# EAGLE board haasoscope_pro_fpga_board - v1.0 (EAGLE 9.6.2), part 1 of 2
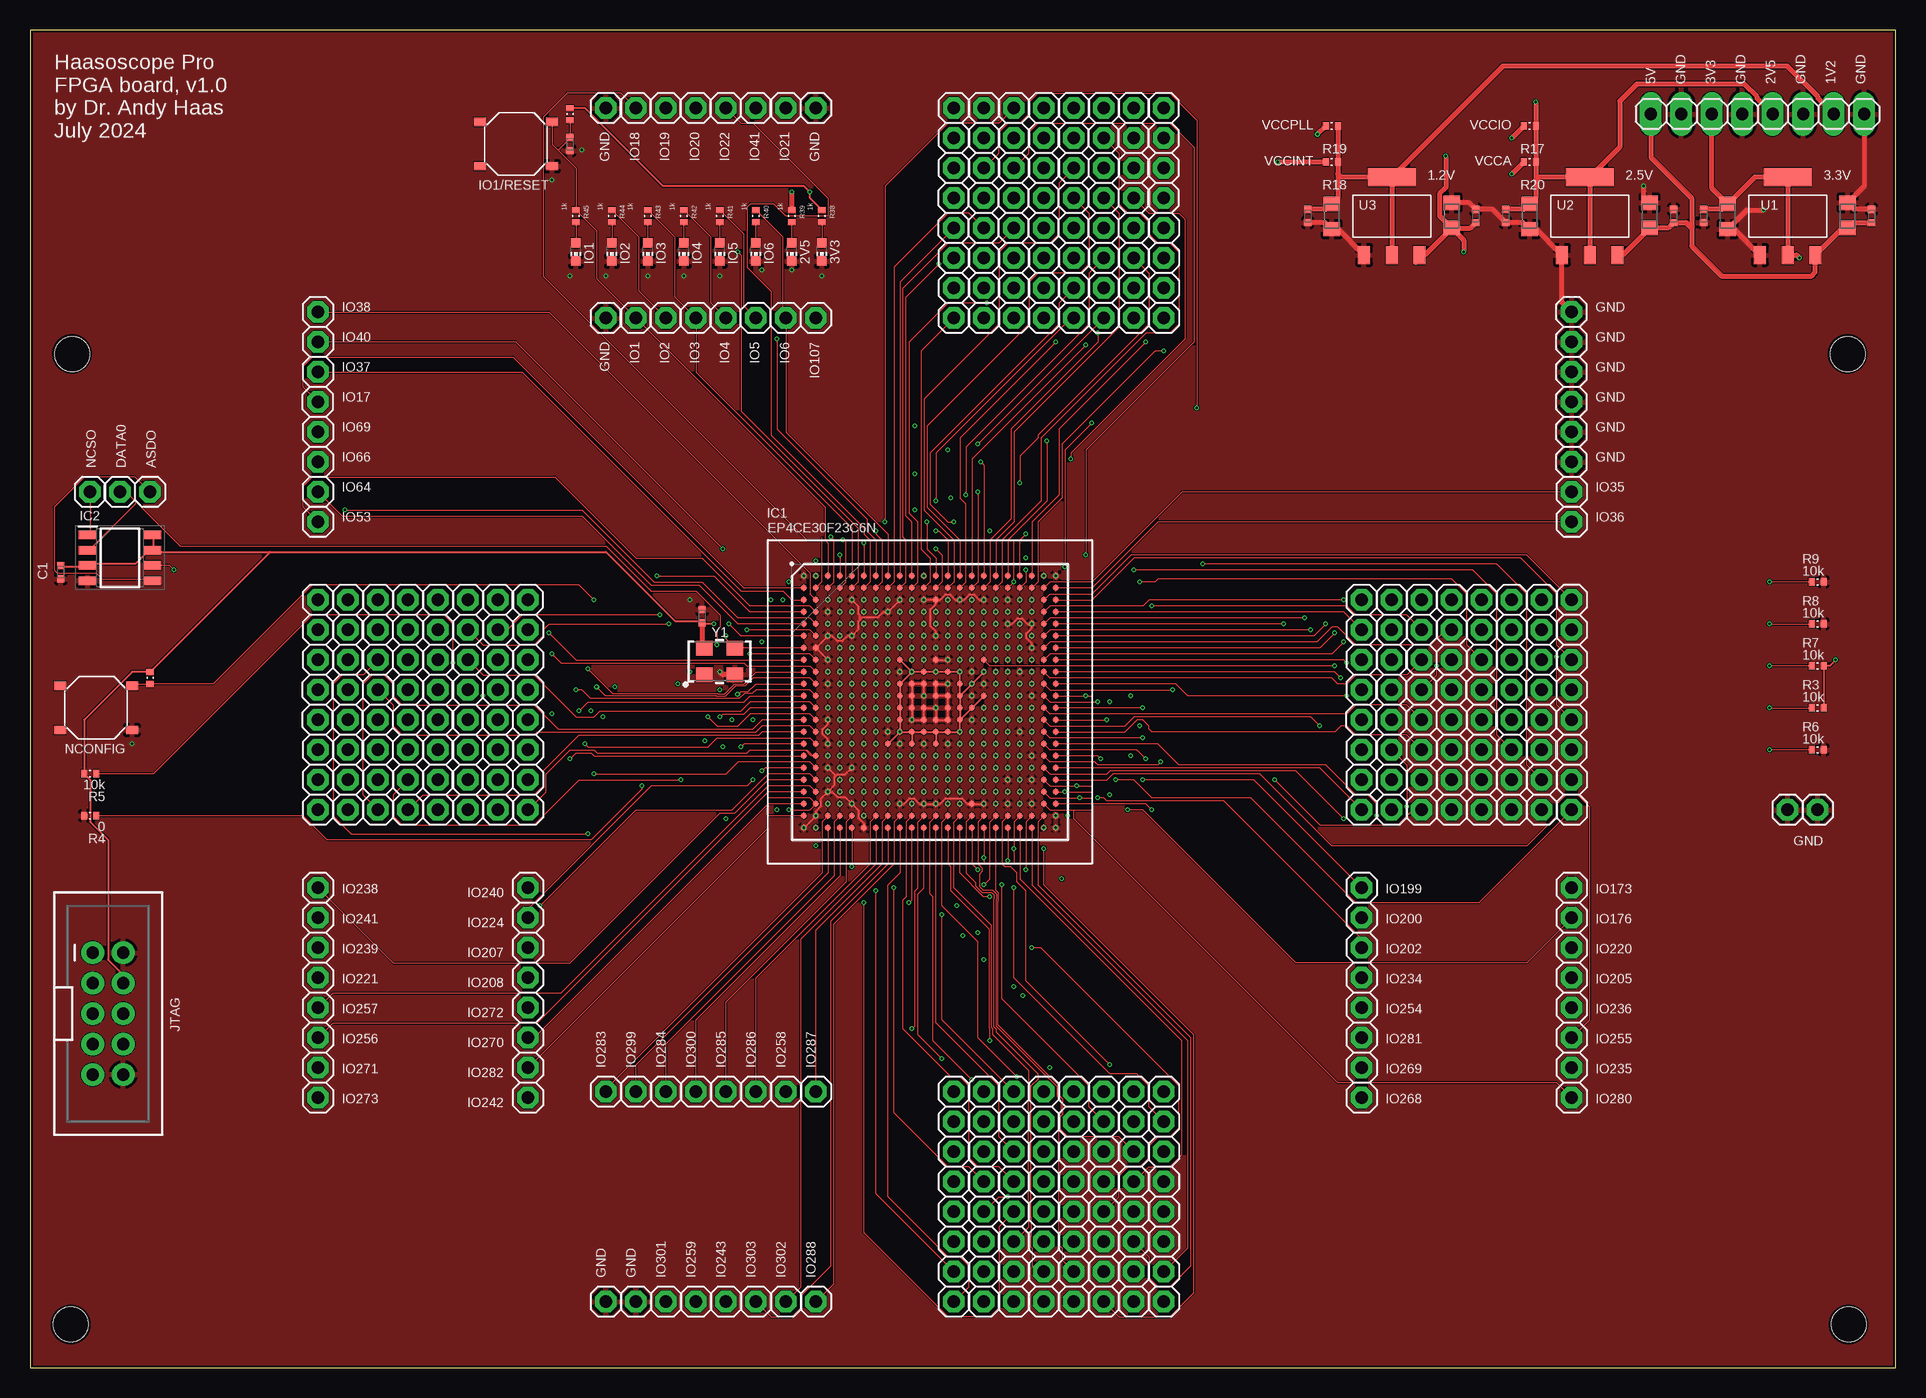
[diagram p4: board, top side]
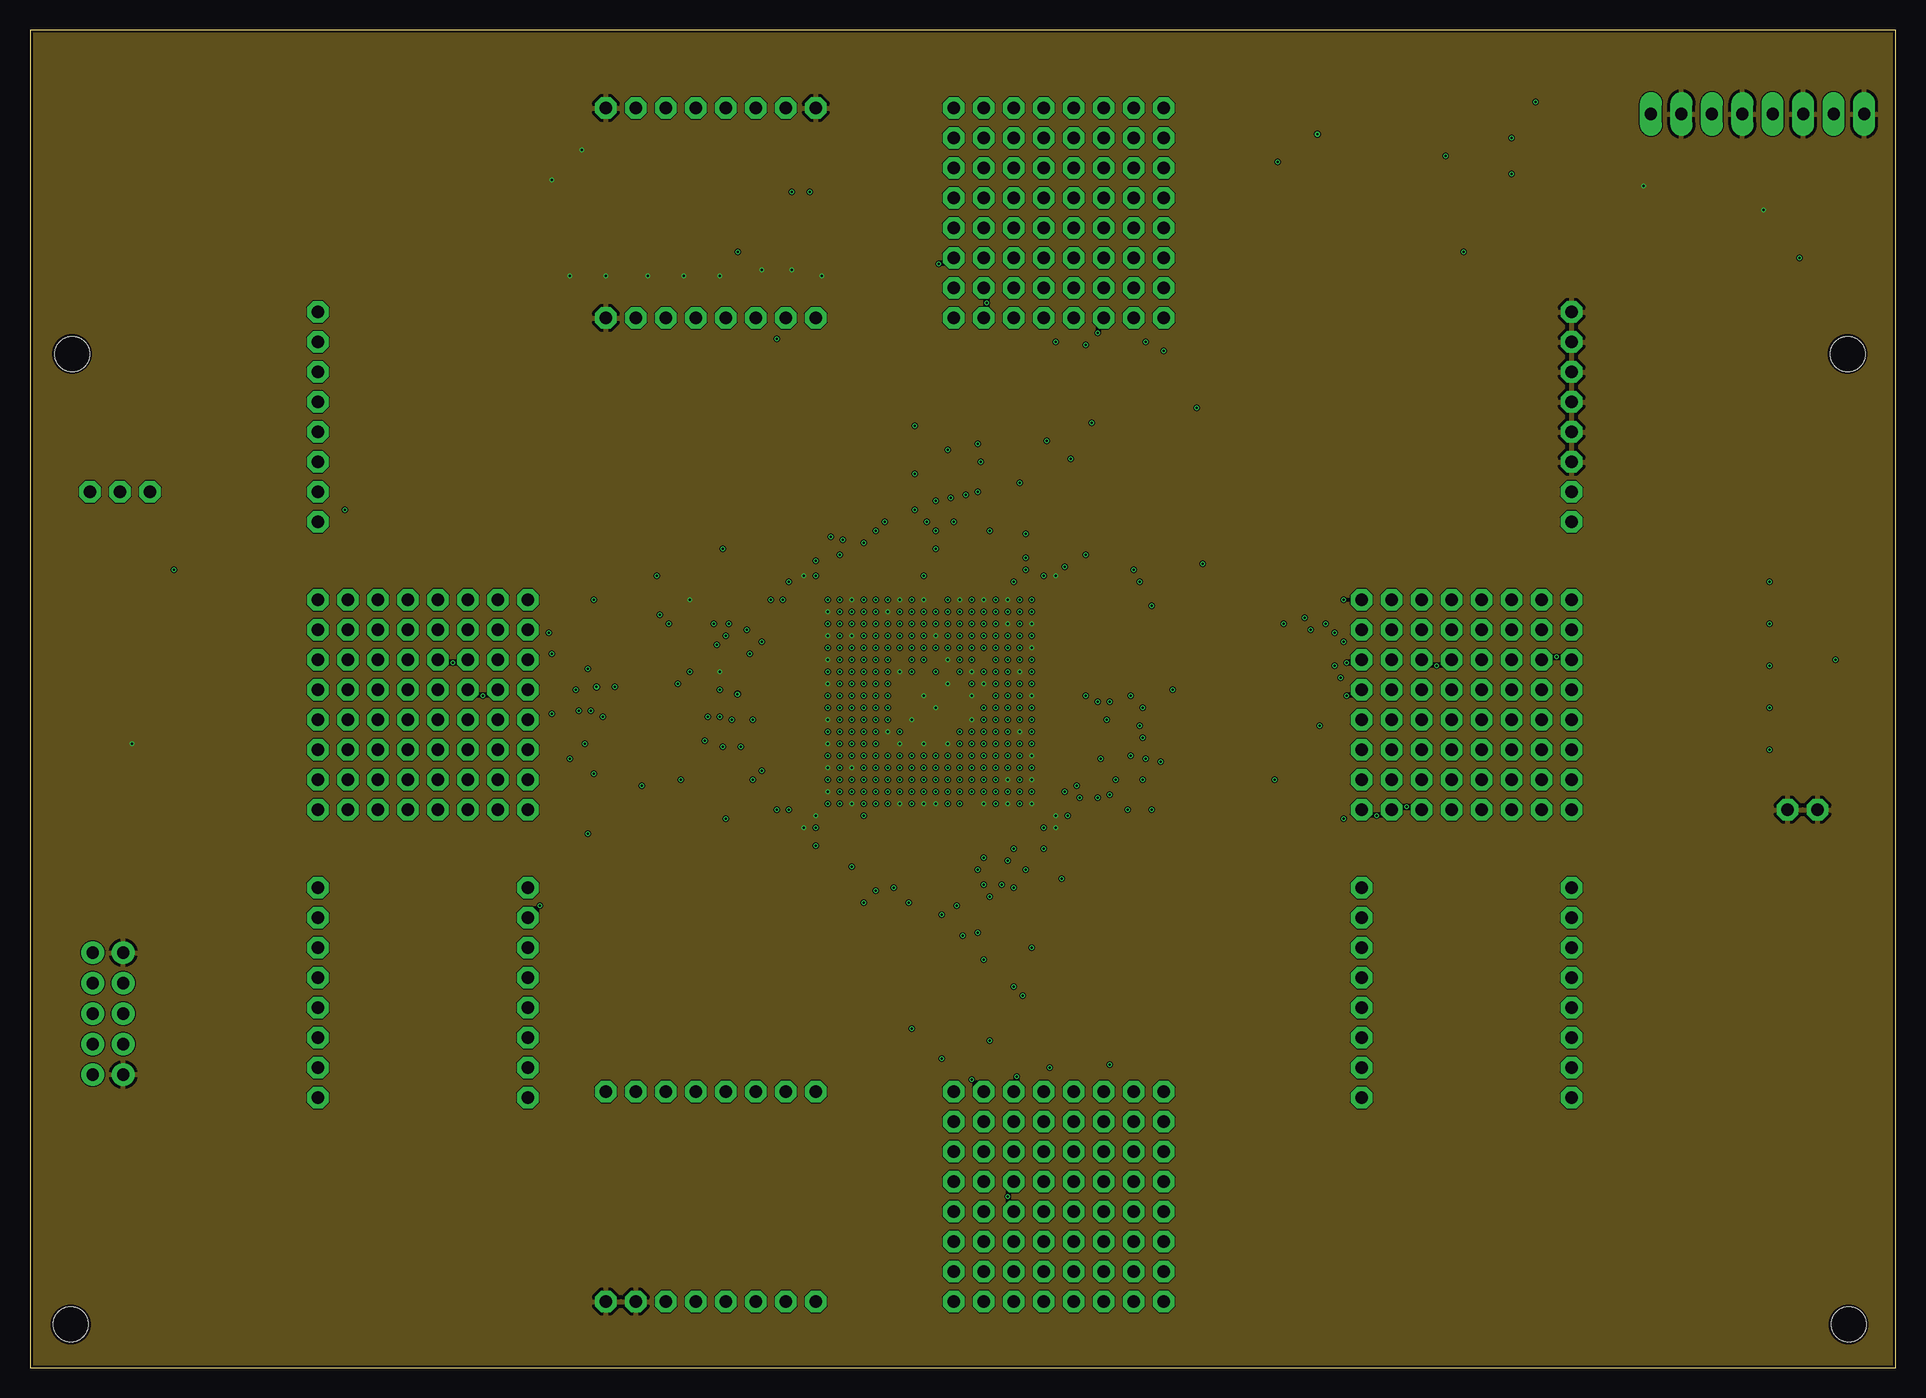
[diagram p5: board, inner layer topgnd]
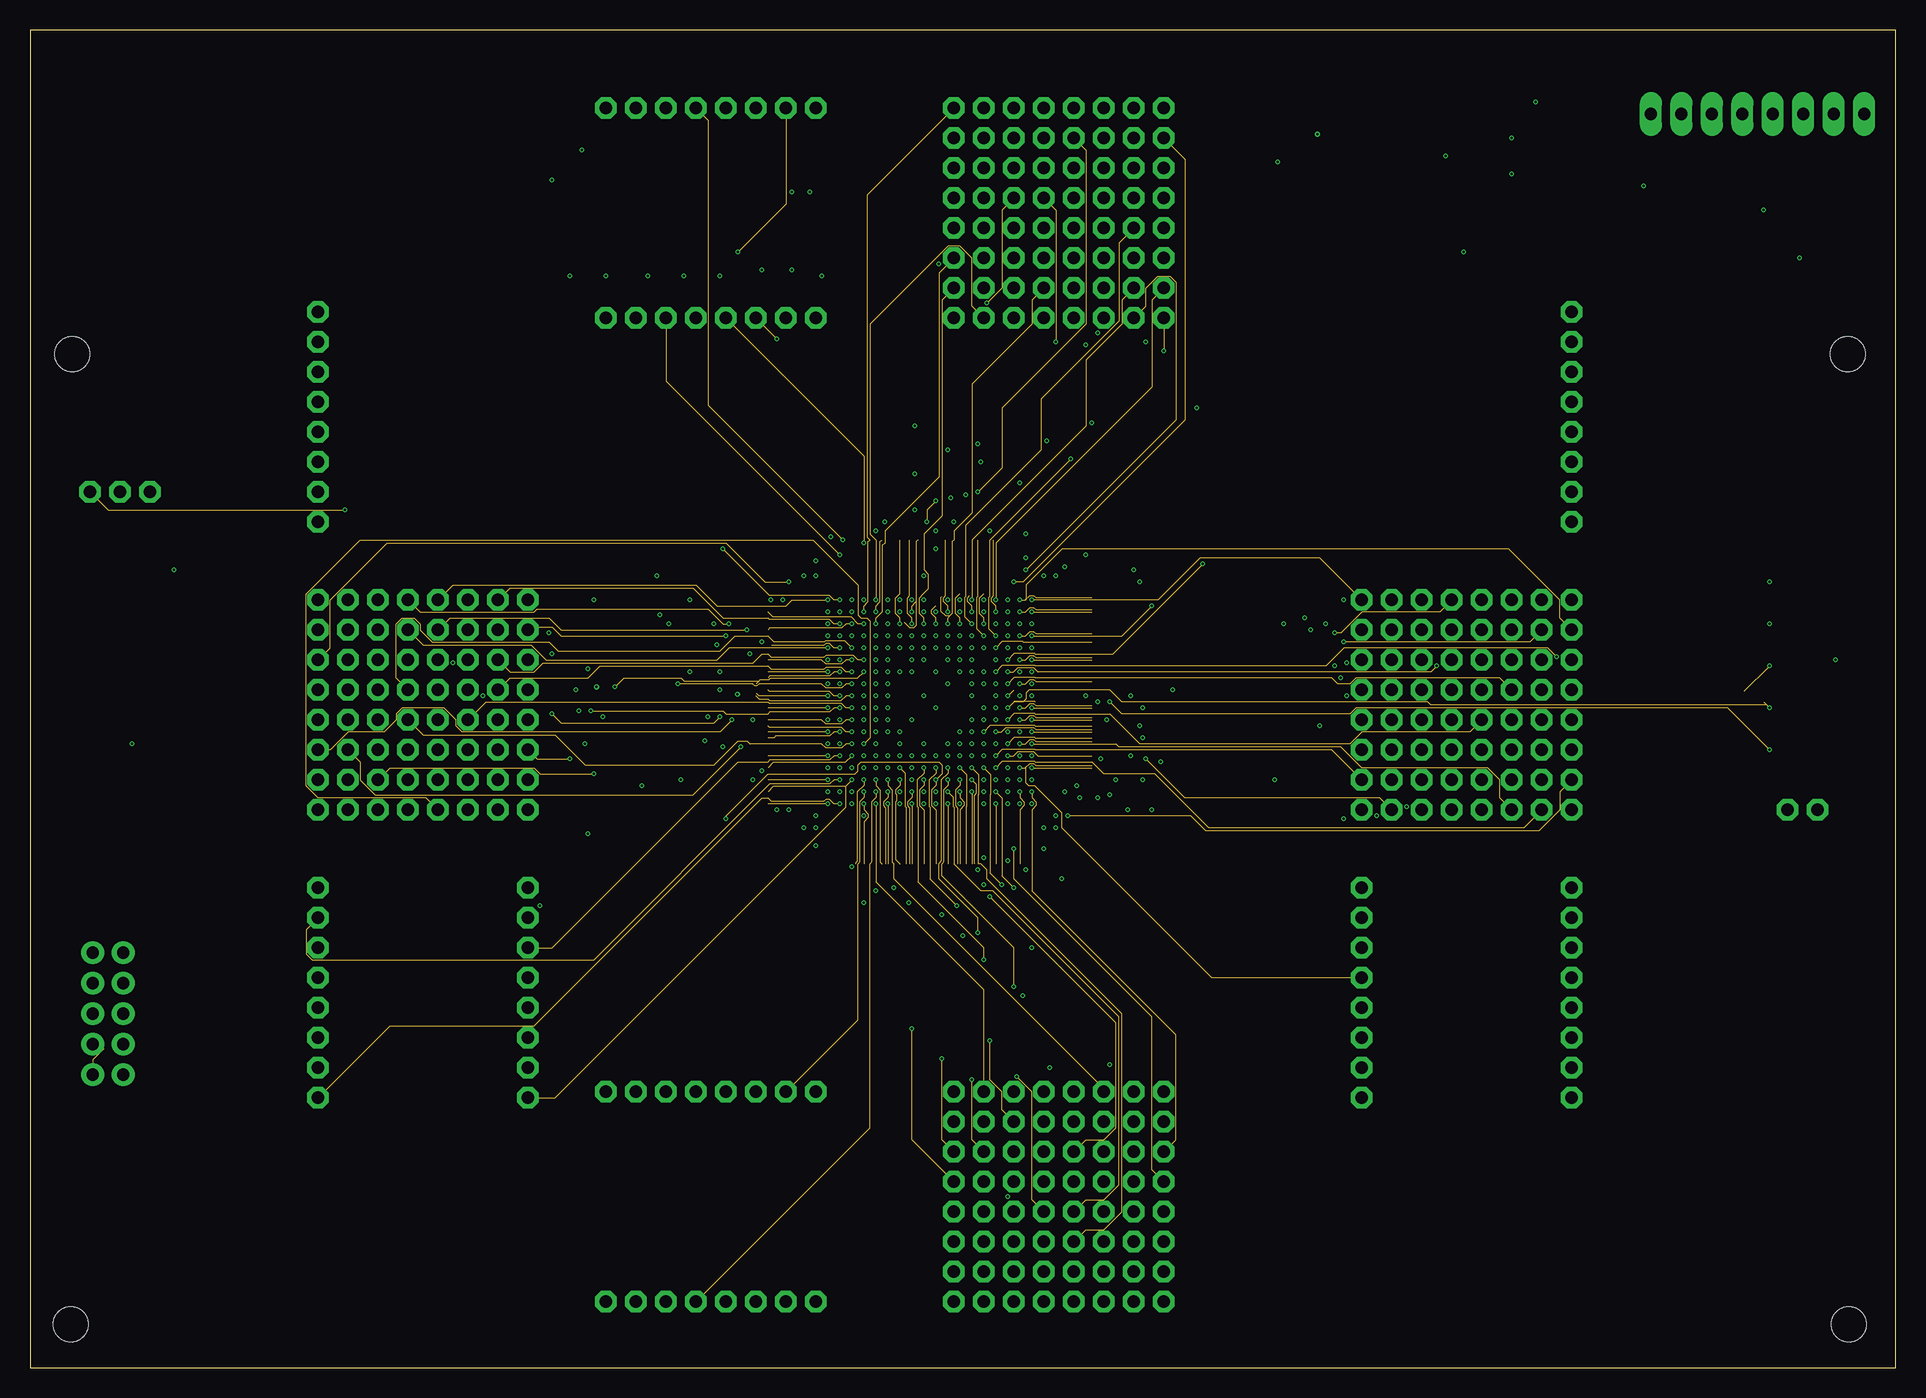
[diagram p6: board, inner layer sig2]
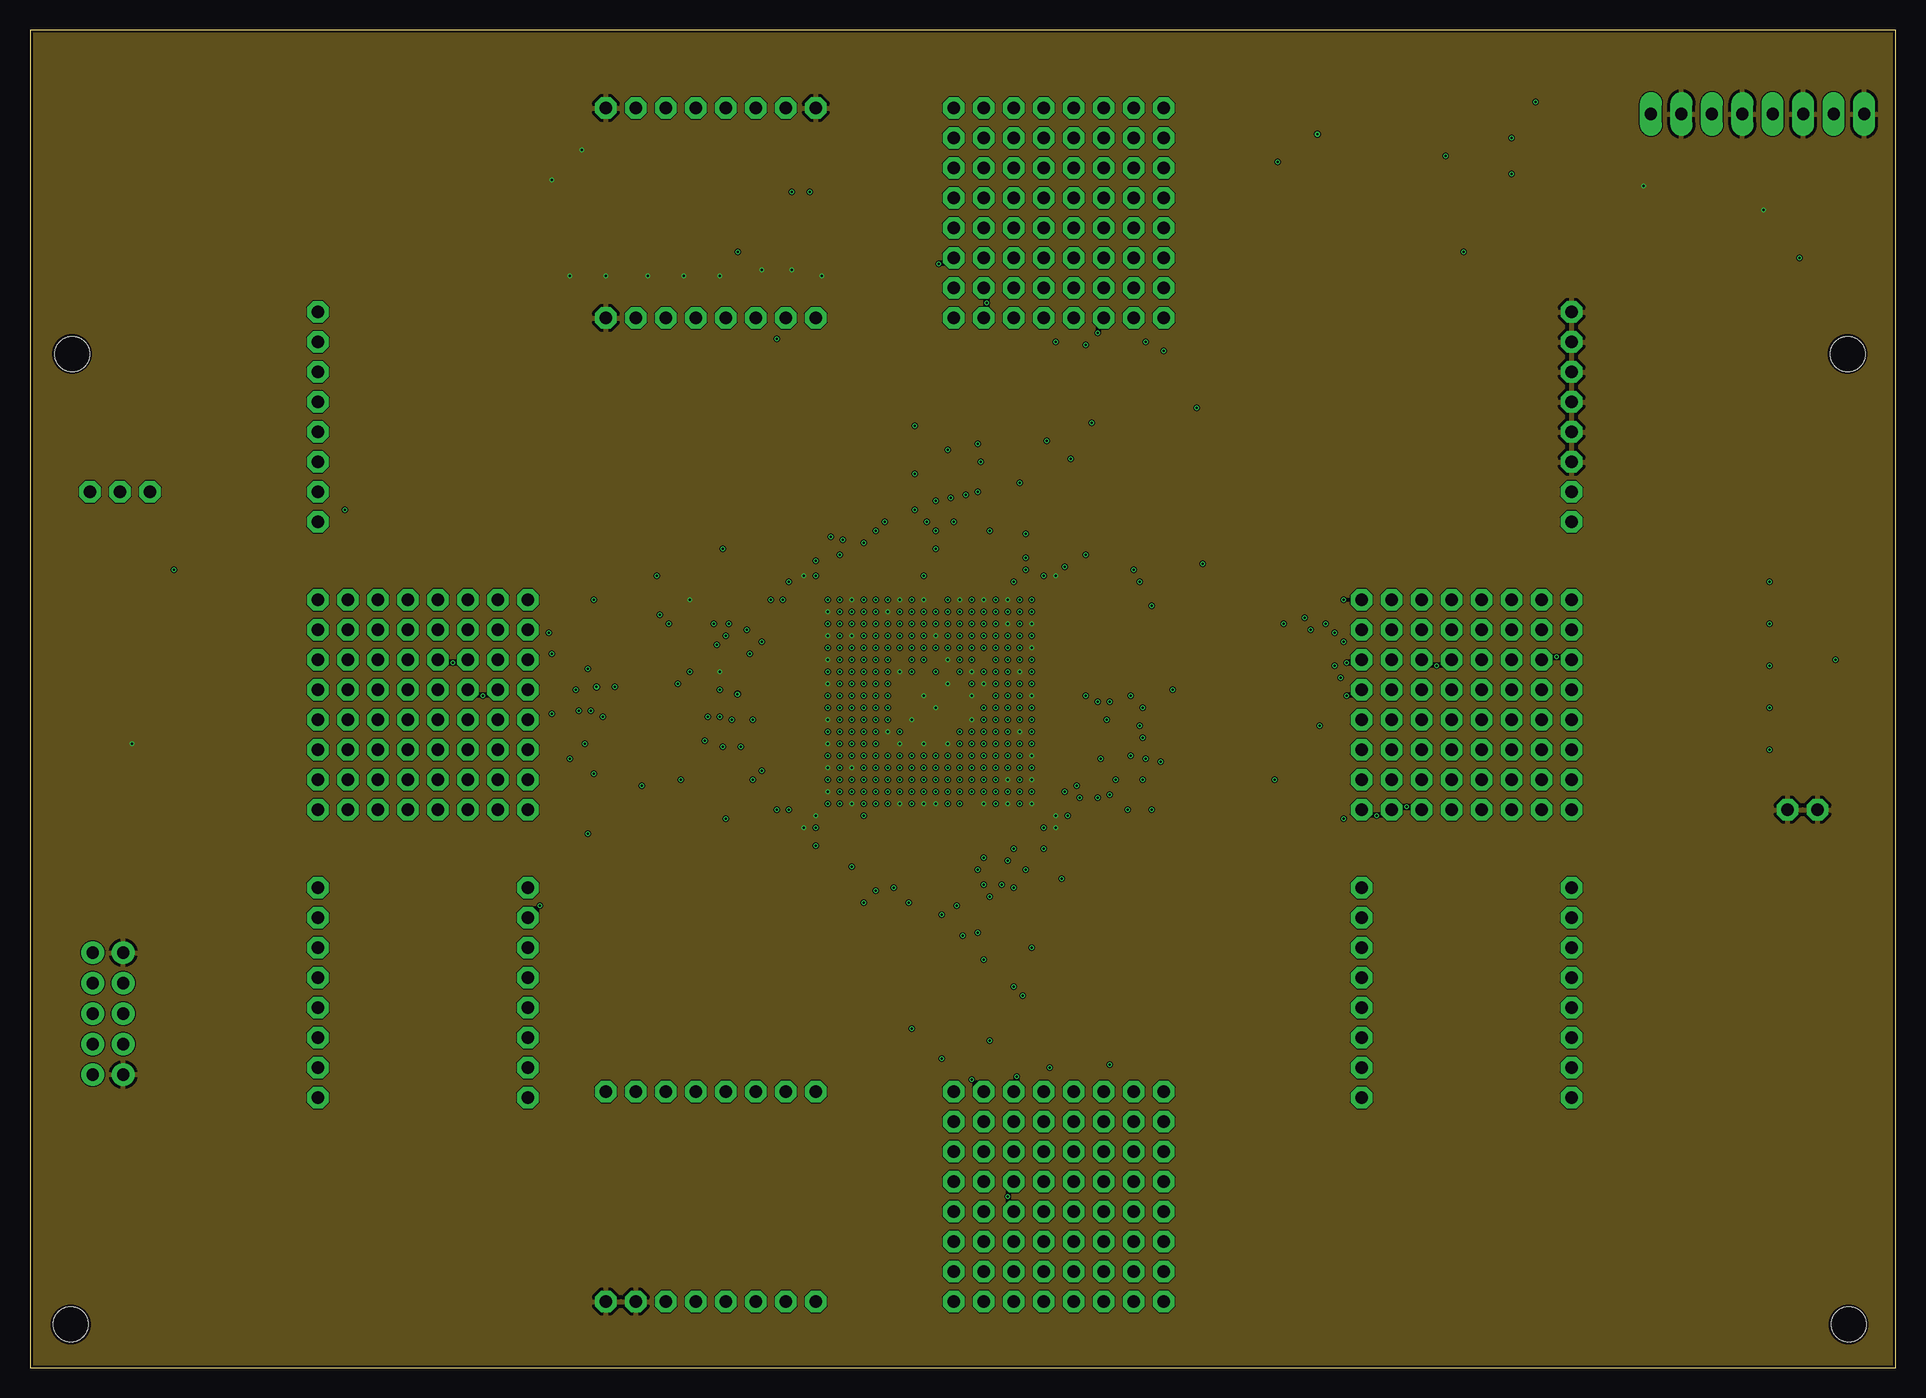
[diagram p7: board, inner layer sig2gnd]
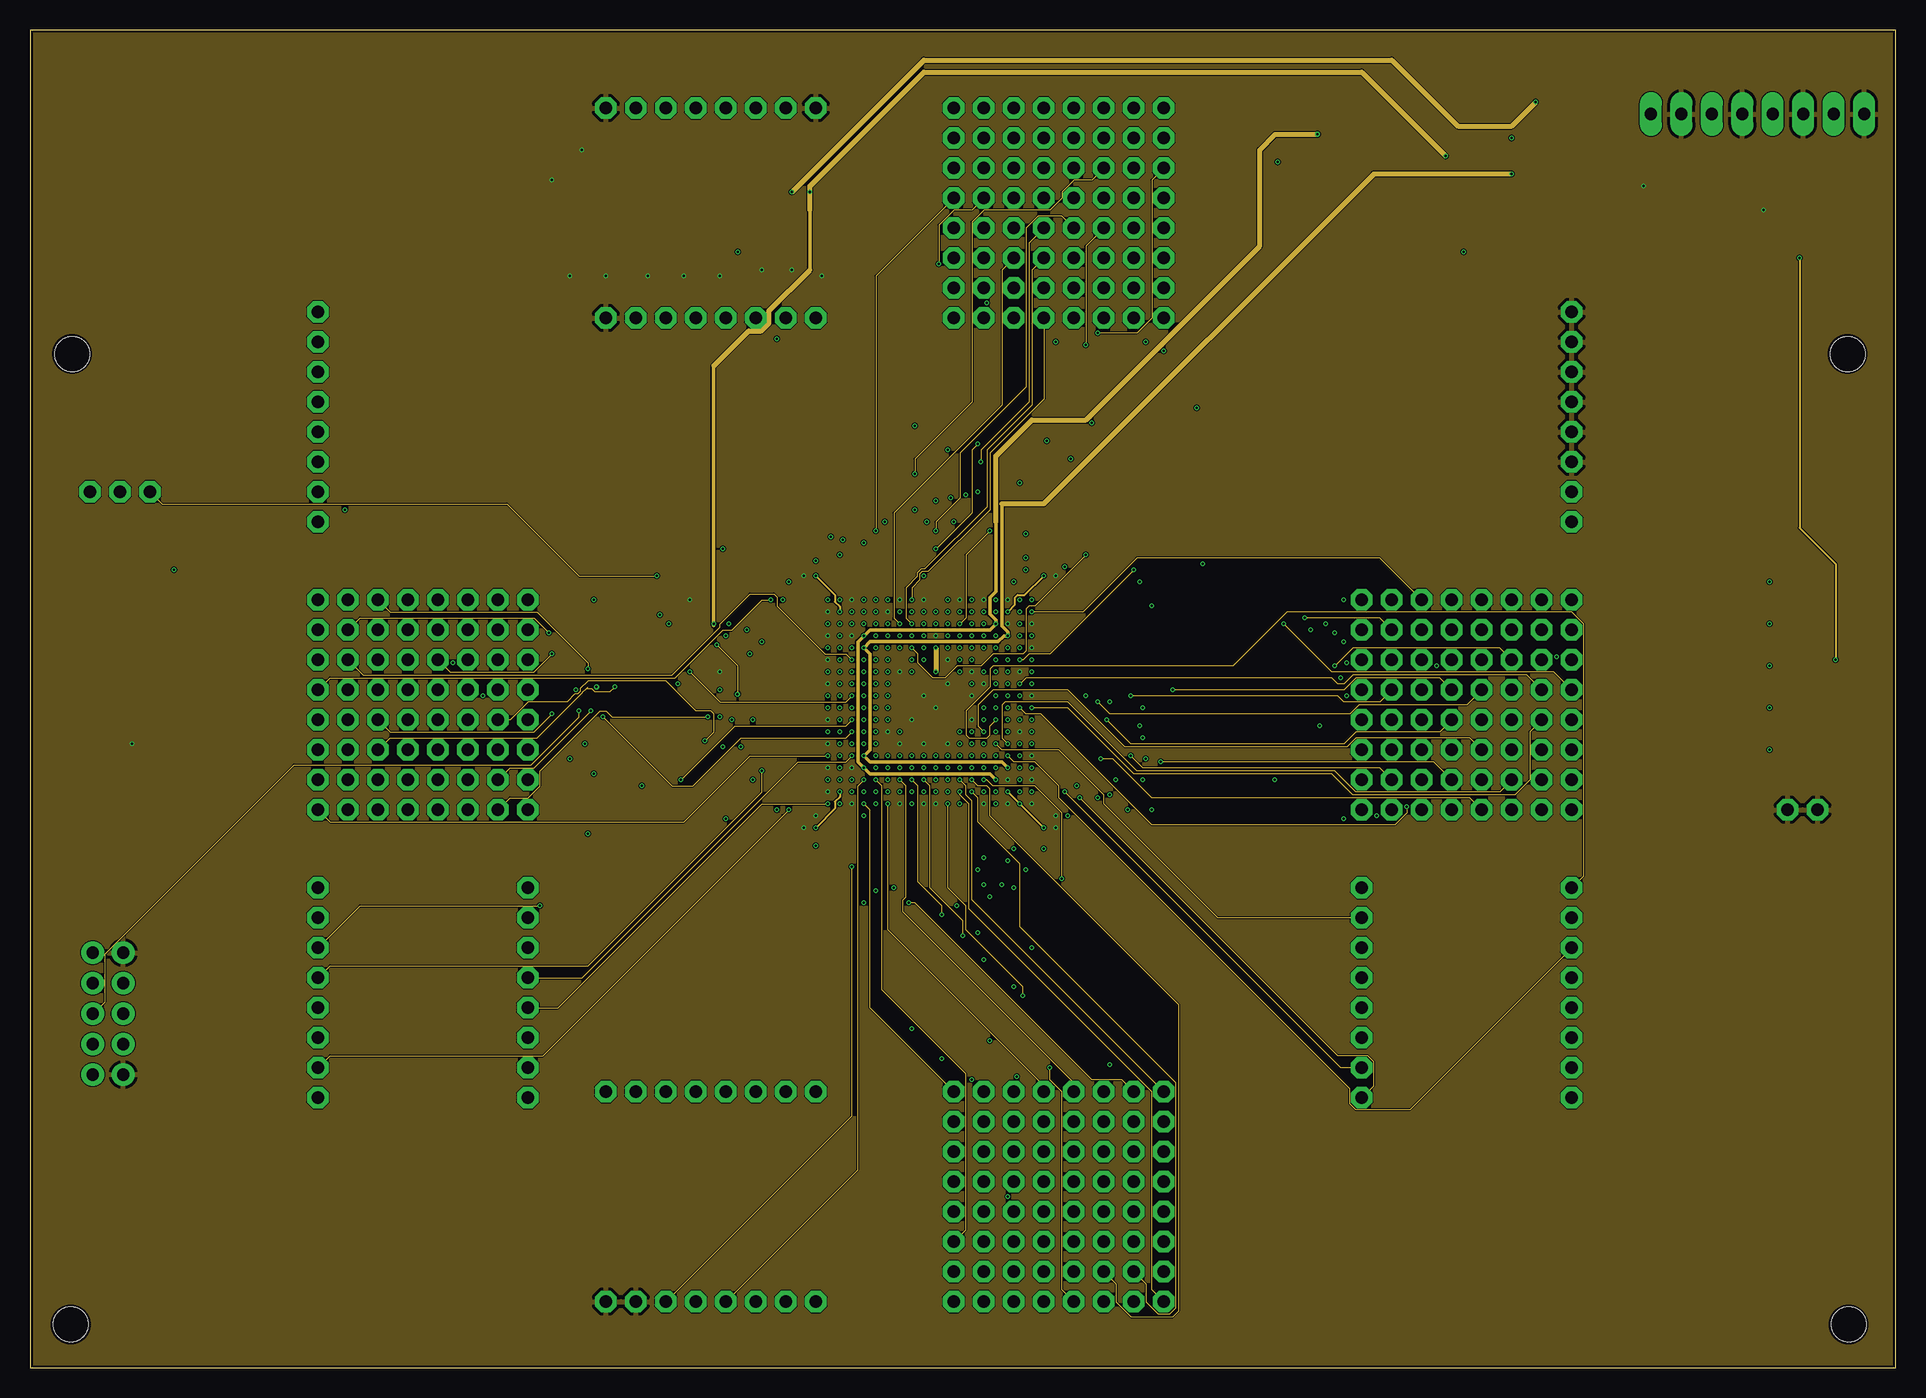
[diagram p8: board, inner layer pow1]
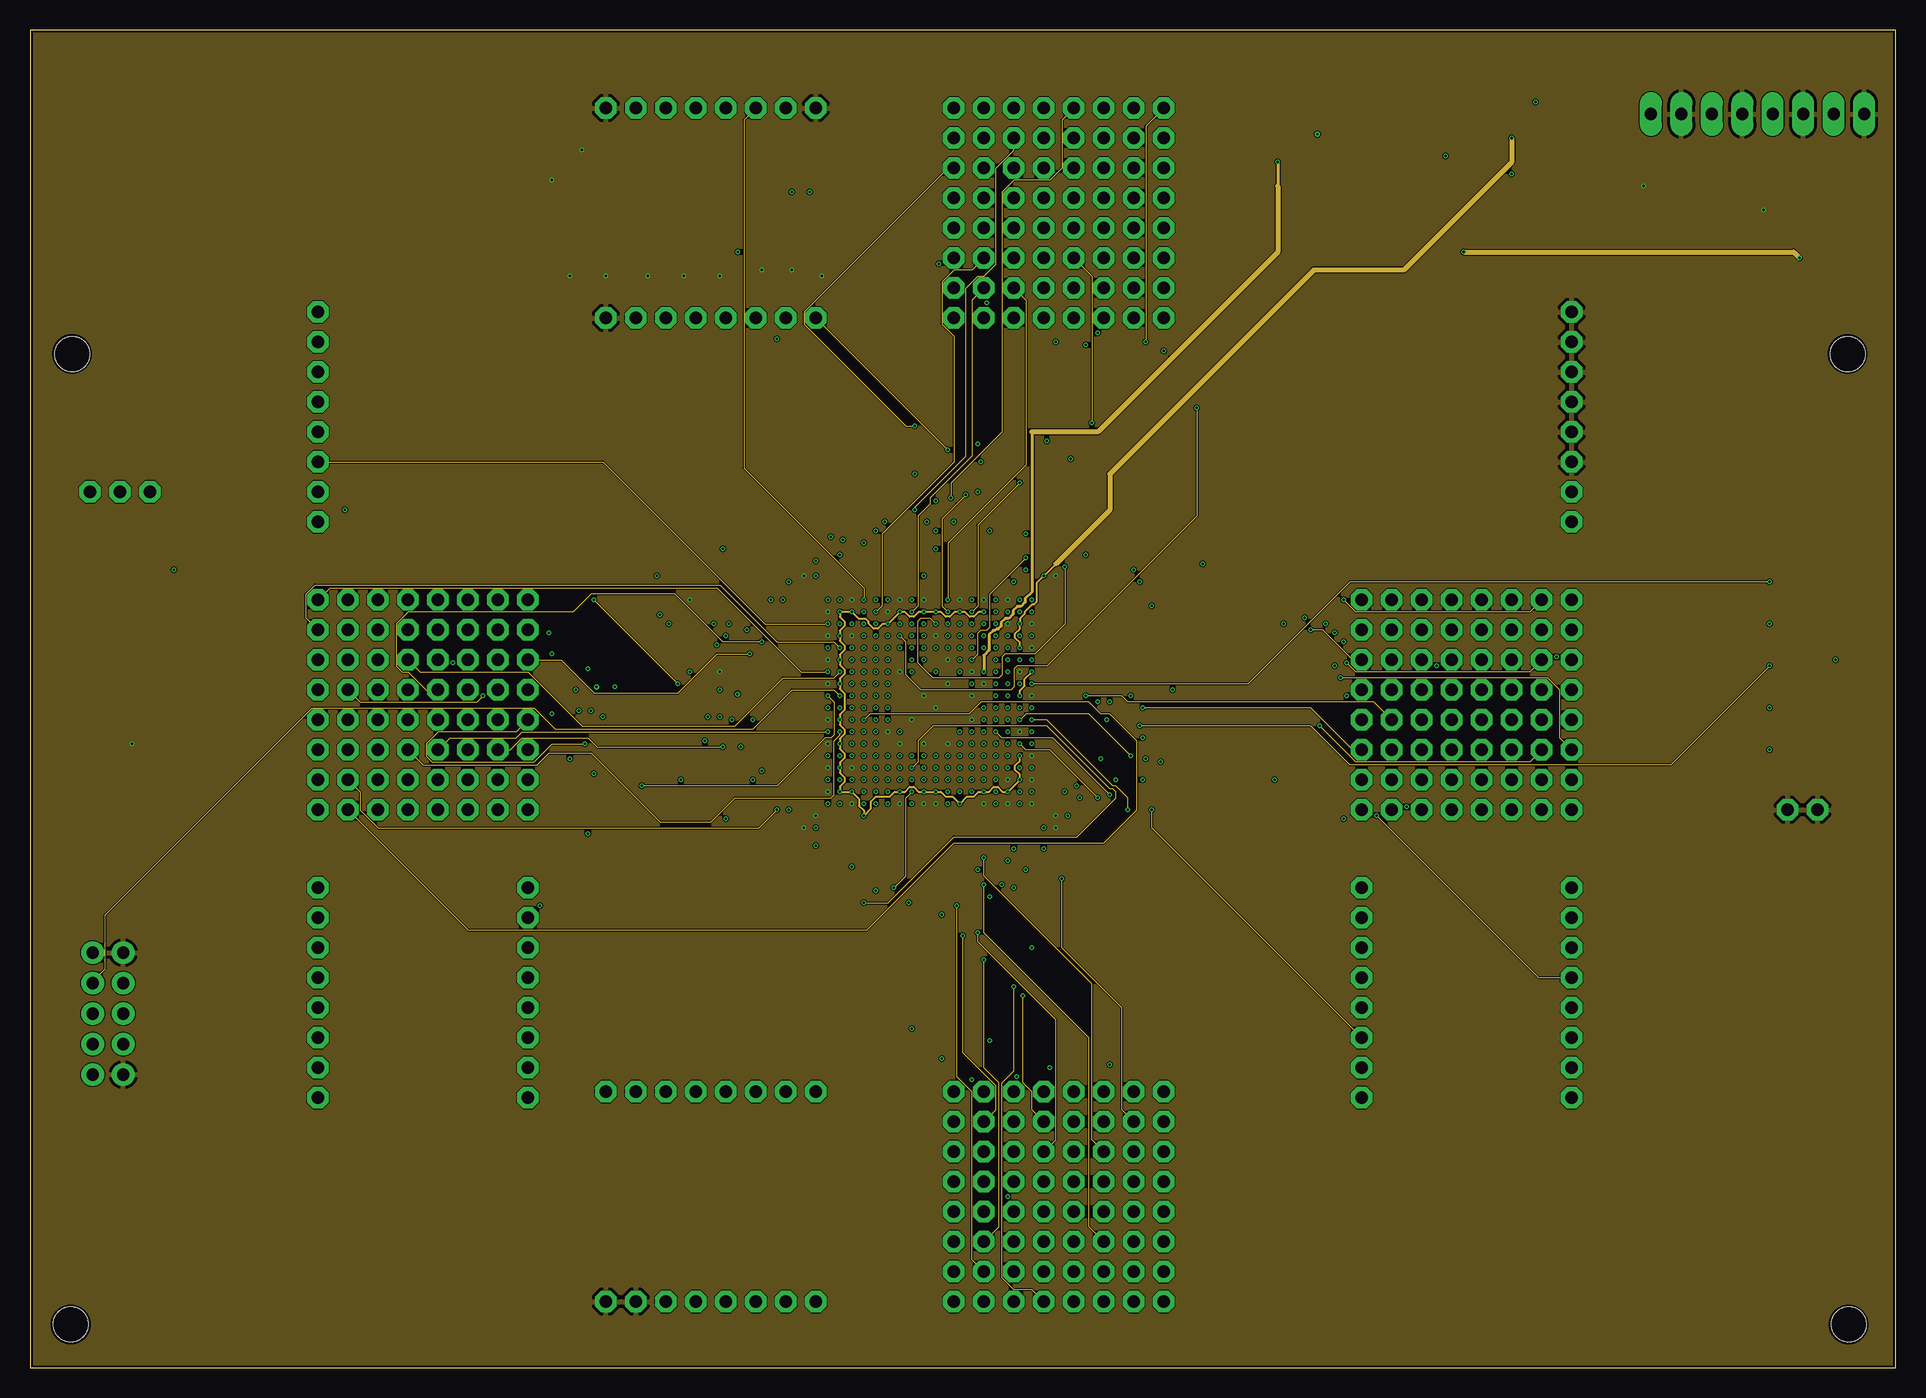
[diagram p9: board, inner layer pow2]
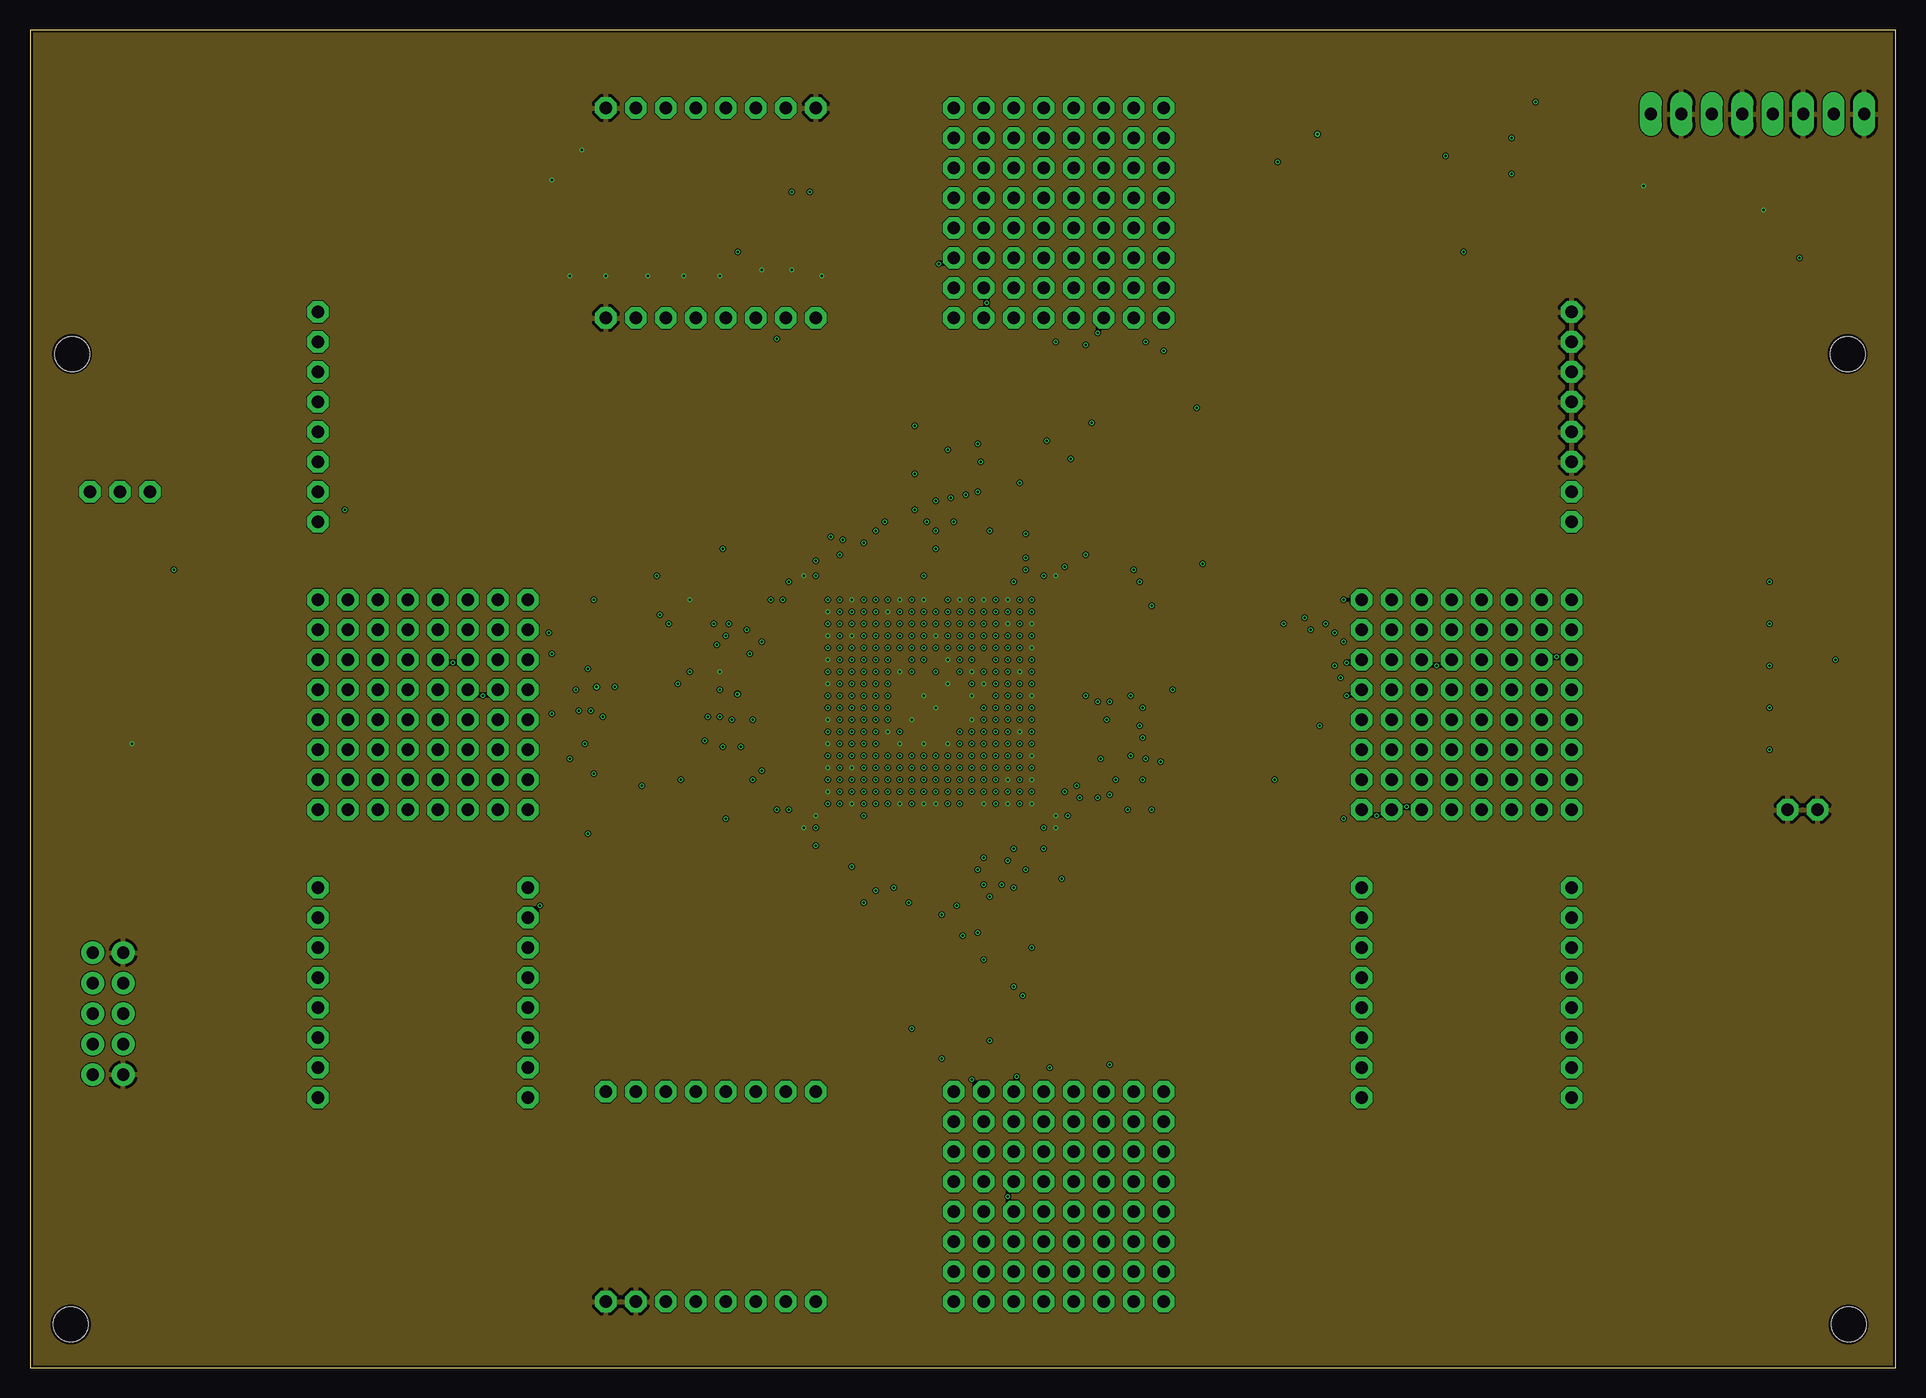
[diagram p10: board, inner layer sig4gnd]
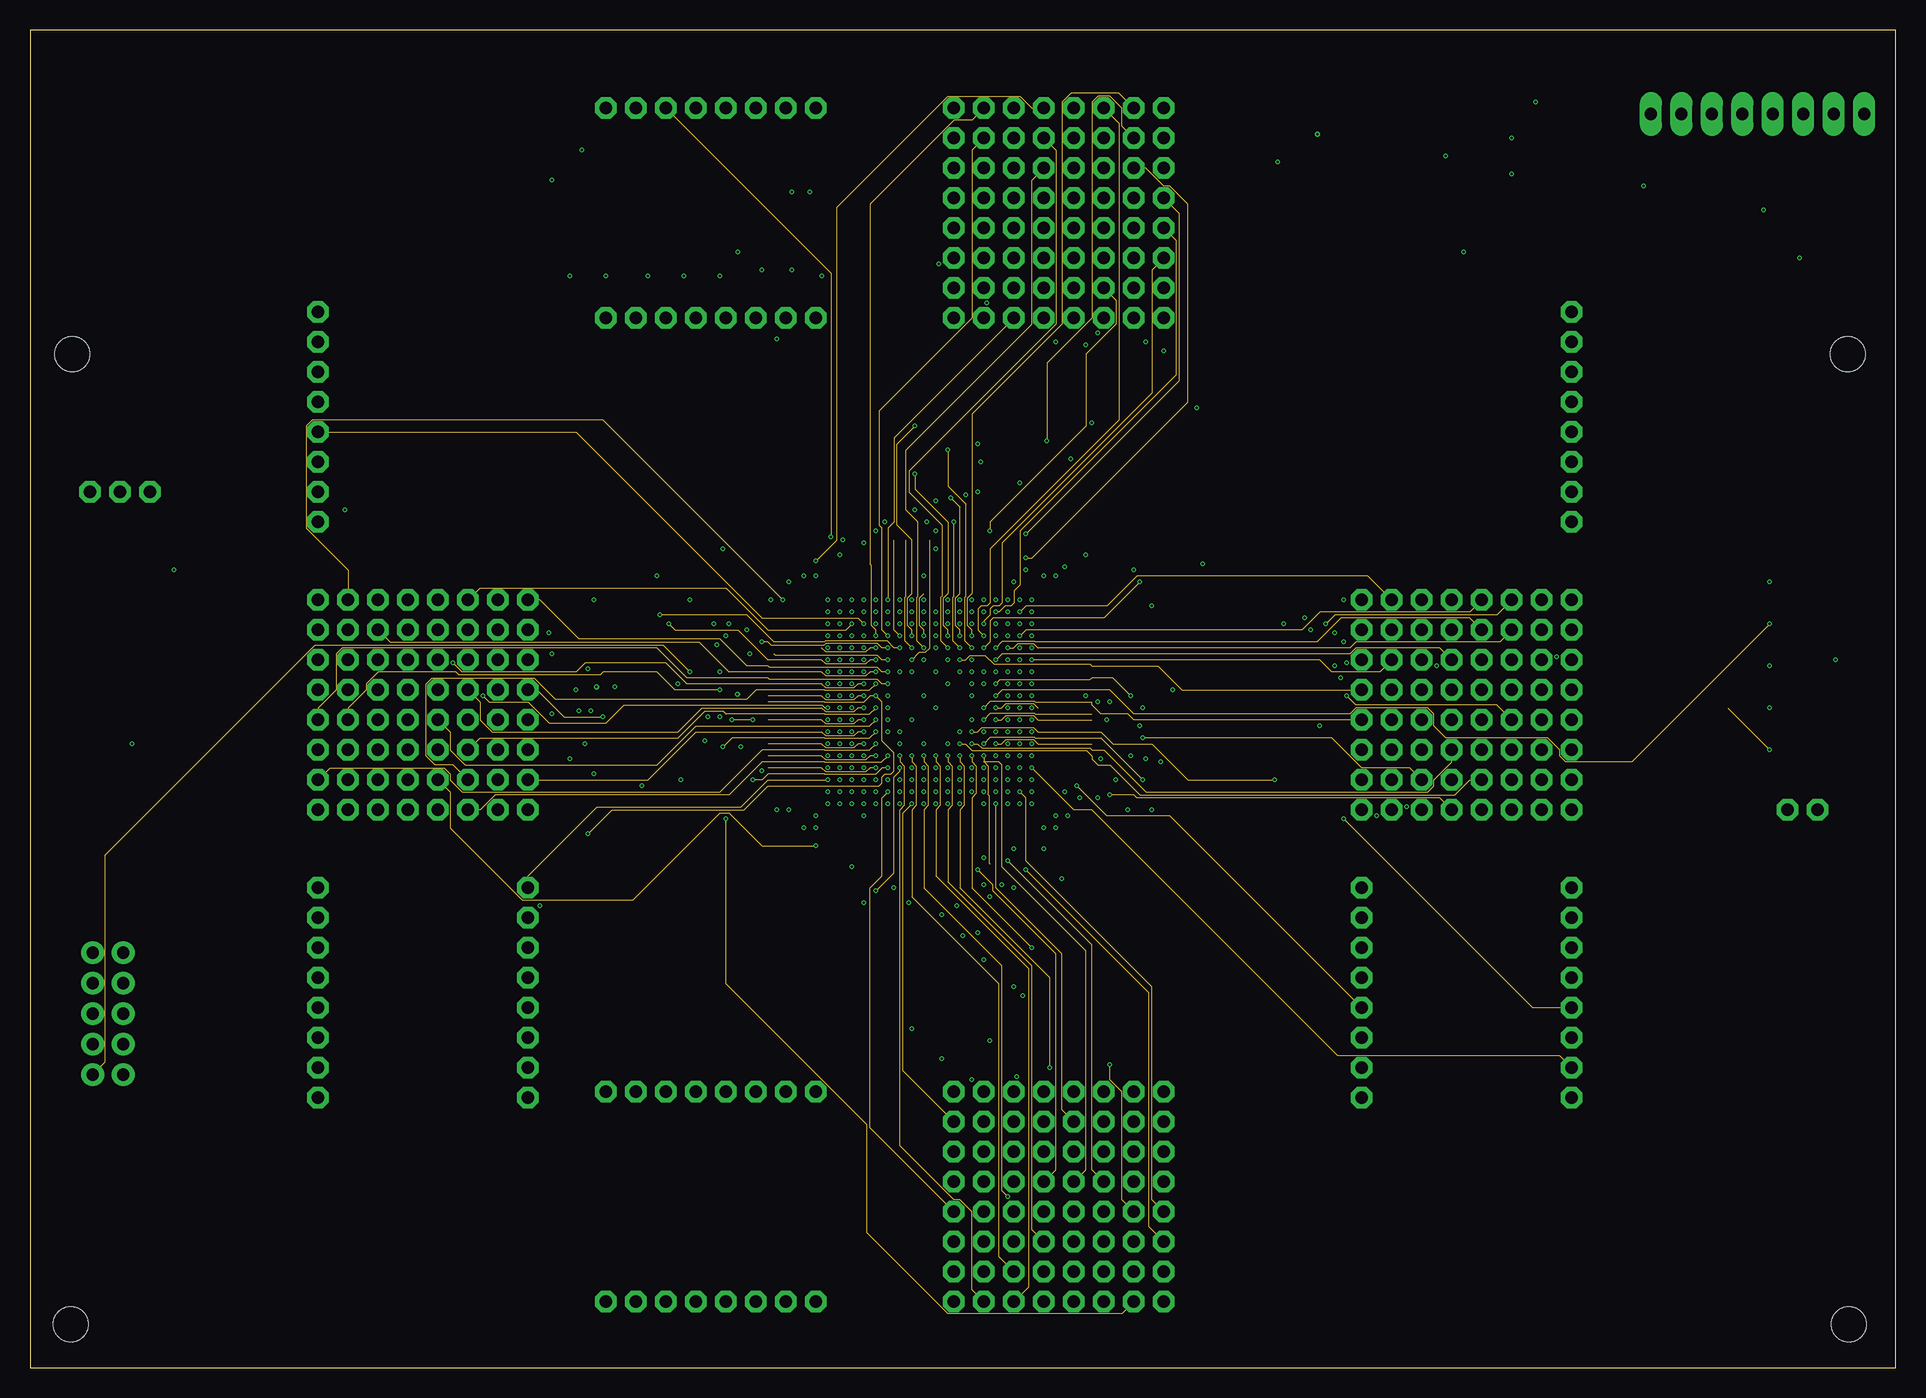
[diagram p11: board, inner layer sig4]
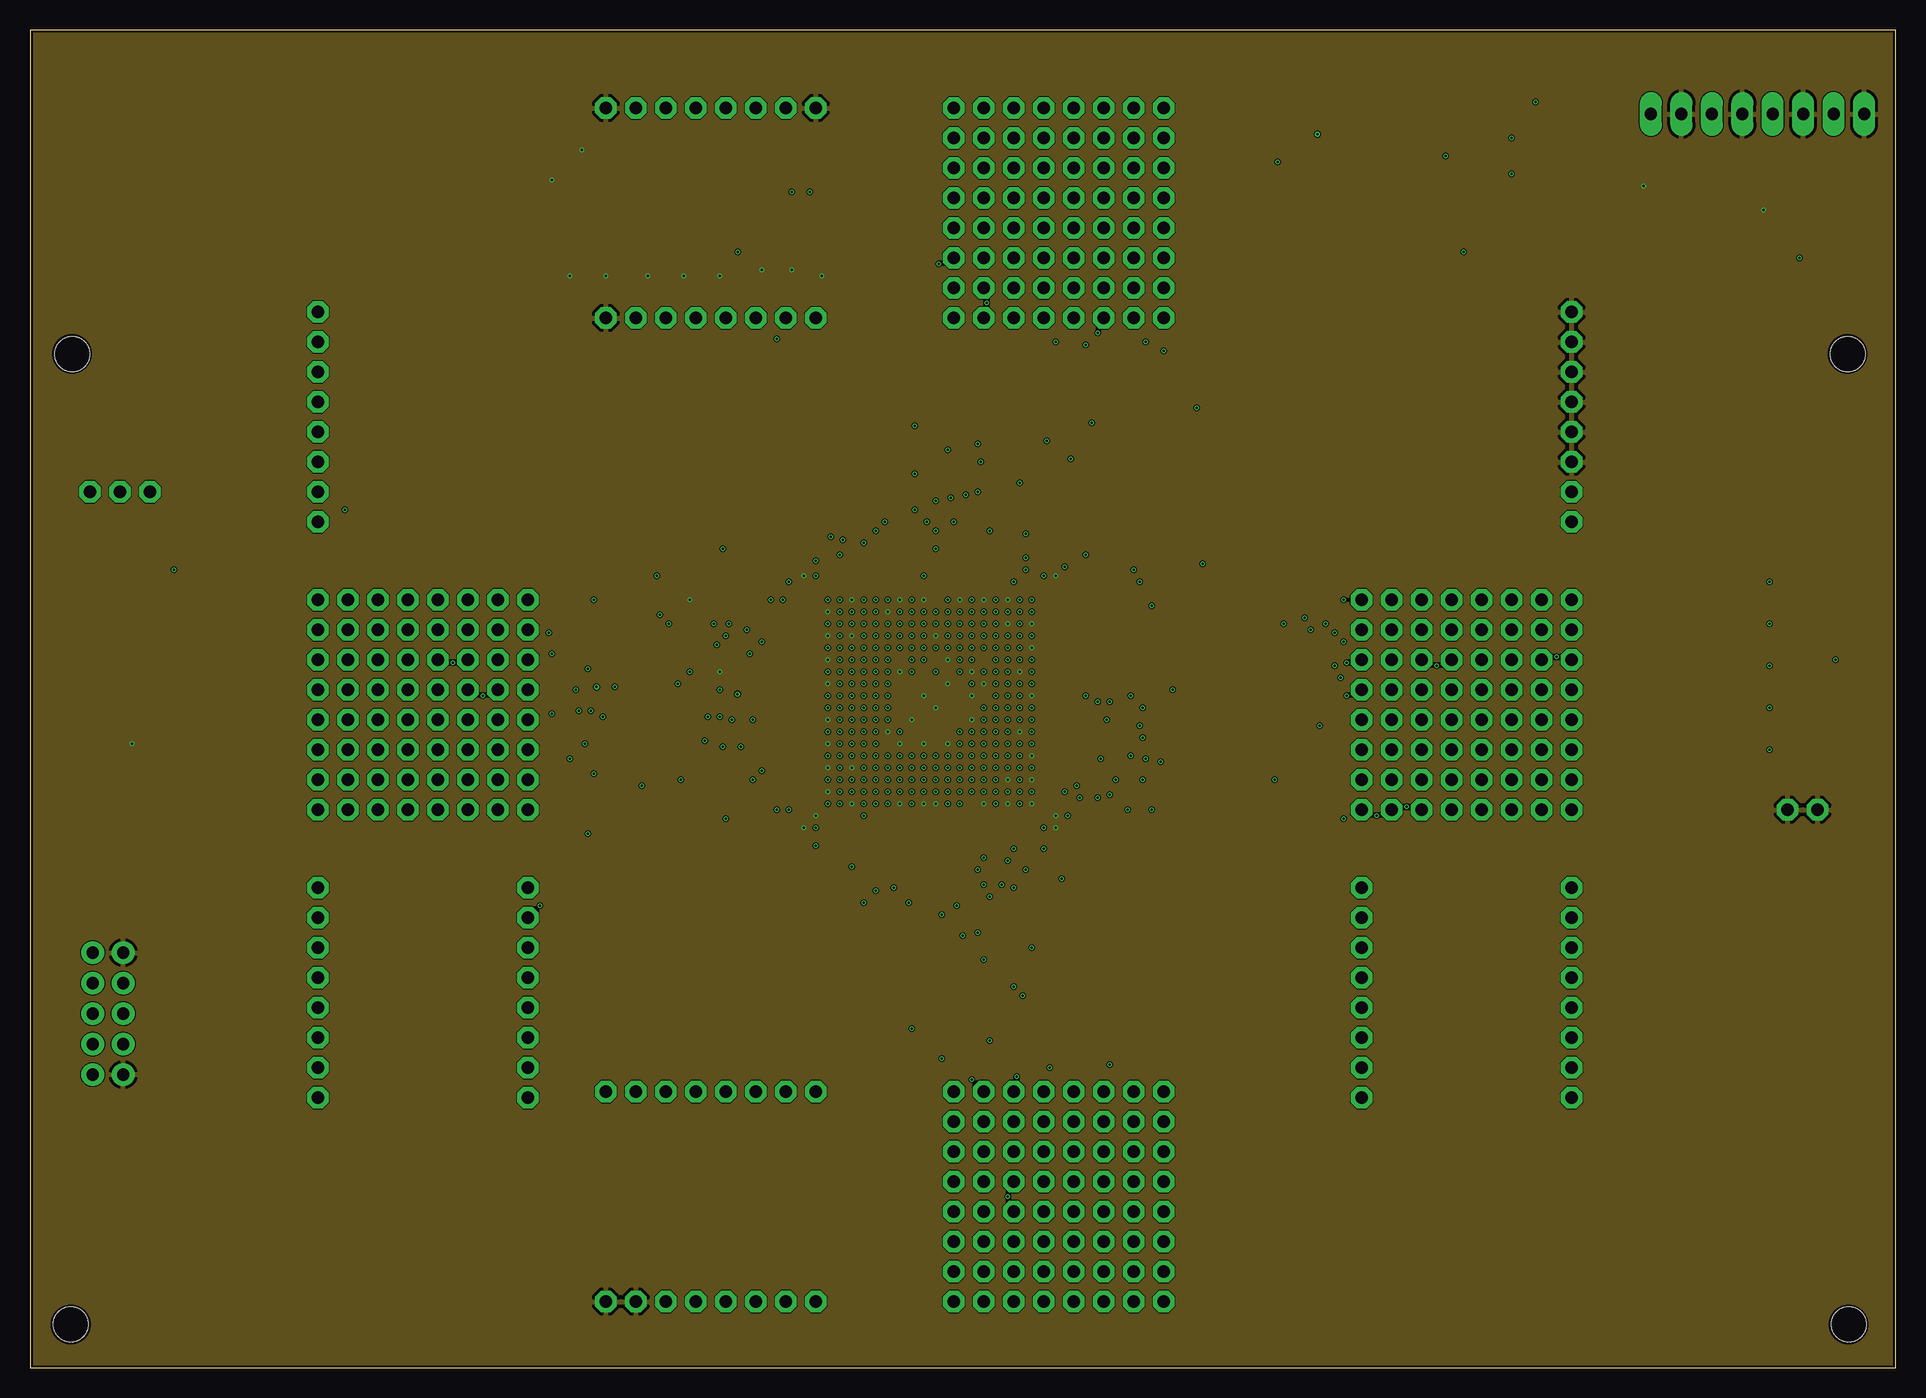
[diagram p12: board, inner layer sig5gnd]
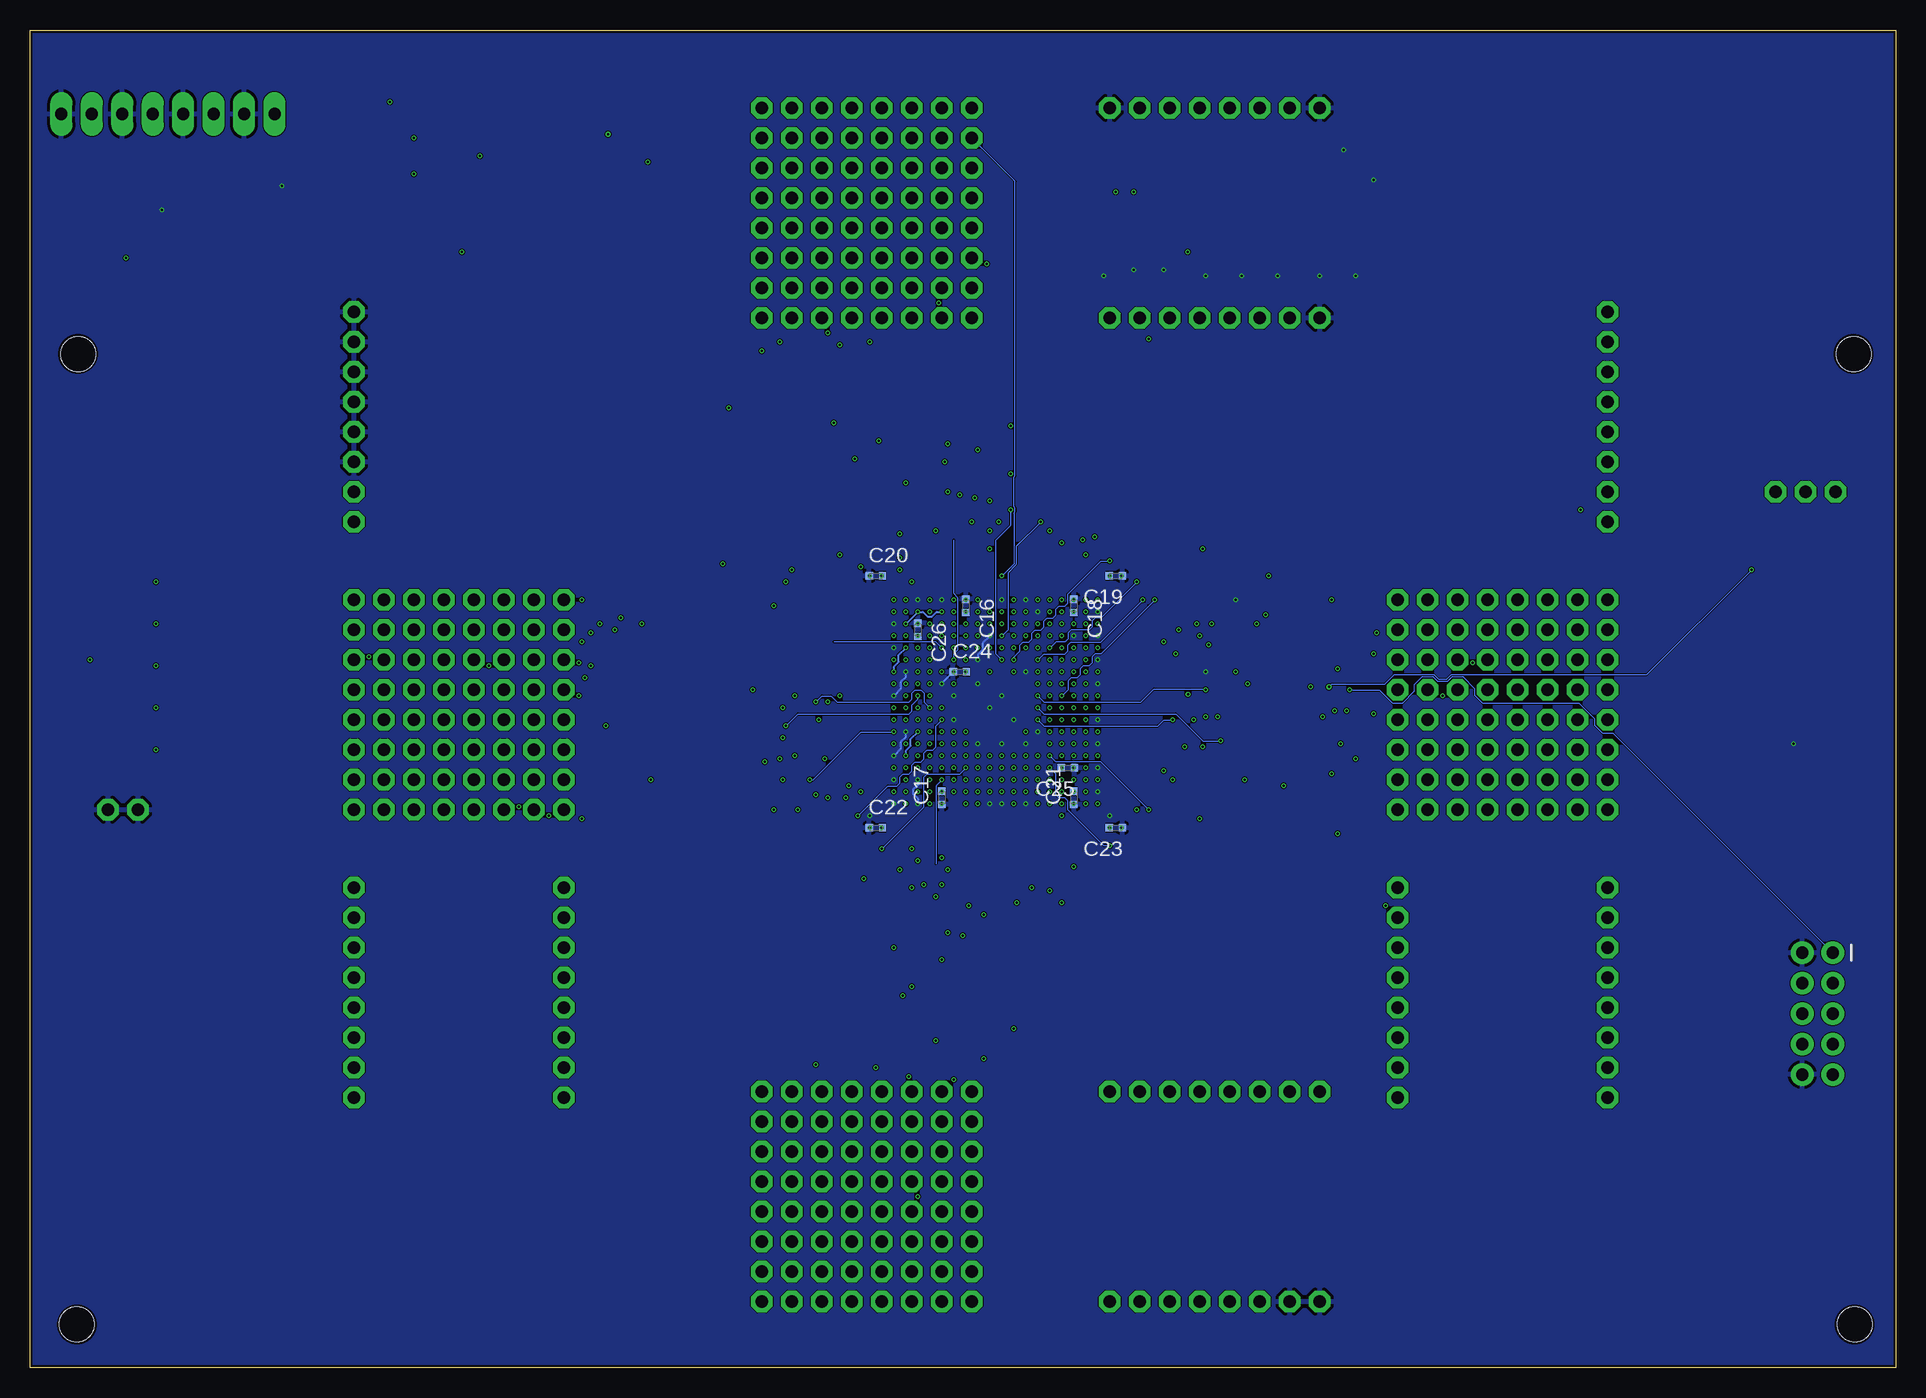
[diagram p13: board, bottom side, seen from below]

Size 155.5 x 111.5 mm. Coordinates in mm from the lower left corner, seen from the top.
Outline: 0,111.5 0,0 155.5,0 155.5,111.5 0,111.5
Copper layers (1+2*3+4*5+12*13+14*15+16): top 0.035mm / dielectric 0.2mm / topgnd 0.0175mm / dielectric 0.15mm / sig2 0.035mm / dielectric 0.2mm / sig2gnd 0.035mm / dielectric 0.15mm / pow1 0.035mm / dielectric 0.2mm / pow2 0.035mm / dielectric 0.15mm / sig4gnd 0.035mm / dielectric 0.2mm / sig4 0.035mm / dielectric 0.15mm / sig5gnd 0.0175mm / dielectric 0.2mm / sig5 0.035mm
Design rules "jlcpcb-10layers-haas": minimum track width 3.5mil, minimum drill 0.2mm, track to track 3.5mil, track to pad 5mil, pad to pad 5mil, via to via 0.5mm, smd to smd 5mil, copper to edge 0.2mm, drill to drill 6mil, minimum pad ring 10mil, minimum via ring 0.1mm, stop-mask expansion 0.05mm, vias tented up to drill 16mil, thermal gap 10mil
Net classes: 0 default: width 0.089 mm; 1 power: width 0.152 mm; 2 diffpair: width 0.089 mm; 3 loosediffpair: width 0.152 mm, clearance 0.305 mm to class 0, clearance 0.305 mm to class 1, clearance 0.305 mm to class 2, clearance 0.305 mm
Holes 2.9 mm at 3.4,3.6 151.6,3.6 3.5,84.5 151.5,84.5

## Footprints (pad centres in the part's own frame; a part is rotated, then mirrored left to right if it is on the bottom)
RESC0402_N = smd 0.6 x 0.6: 1 -0.55,0; 2 0.55,0
RESC0805_N = smd 1.2 x 1.35: 1 -1.1,0; 2 1,0
BGA484C100P22X22_2300X2300X240 = smd 0.5 x 0.5: A1 -10.5,10.5; A2 -9.5,10.5; A3 -8.5,10.5; A4 -7.5,10.5; A5 -6.5,10.5; A6 -5.5,10.5; A7 -4.5,10.5; A8 -3.5,10.5; A9 -2.5,10.5; A10 -1.5,10.5; A11 -0.5,10.5; A12 0.5,10.5; A13 1.5,10.5; A14 2.5,10.5; A15 3.5,10.5; A16 4.5,10.5; A17 5.5,10.5; A18 6.5,10.5; A19 7.5,10.5; A20 8.5,10.5; A21 9.5,10.5; A22 10.5,10.5; AA1 -10.5,-9.5; AA2 -9.5,-9.5; AA3 -8.5,-9.5; AA4 -7.5,-9.5; AA5 -6.5,-9.5; AA6 -5.5,-9.5; AA7 -4.5,-9.5; AA8 -3.5,-9.5; AA9 -2.5,-9.5; AA10 -1.5,-9.5; AA11 -0.5,-9.5; AA12 0.5,-9.5; AA13 1.5,-9.5; AA14 2.5,-9.5; AA15 3.5,-9.5; AA16 4.5,-9.5; AA17 5.5,-9.5; AA18 6.5,-9.5; AA19 7.5,-9.5; AA20 8.5,-9.5; AA21 9.5,-9.5; AA22 10.5,-9.5; AB1 -10.5,-10.5; AB2 -9.5,-10.5; AB3 -8.5,-10.5; AB4 -7.5,-10.5; AB5 -6.5,-10.5; AB6 -5.5,-10.5; AB7 -4.5,-10.5; AB8 -3.5,-10.5; AB9 -2.5,-10.5; AB10 -1.5,-10.5; AB11 -0.5,-10.5; AB12 0.5,-10.5; AB13 1.5,-10.5; AB14 2.5,-10.5; AB15 3.5,-10.5; AB16 4.5,-10.5; AB17 5.5,-10.5; AB18 6.5,-10.5; AB19 7.5,-10.5; AB20 8.5,-10.5; AB21 9.5,-10.5; AB22 10.5,-10.5; B1 -10.5,9.5; B2 -9.5,9.5; B3 -8.5,9.5; B4 -7.5,9.5; B5 -6.5,9.5; B6 -5.5,9.5; B7 -4.5,9.5; B8 -3.5,9.5; B9 -2.5,9.5; B10 -1.5,9.5; B11 -0.5,9.5; B12 0.5,9.5; B13 1.5,9.5; B14 2.5,9.5; B15 3.5,9.5; B16 4.5,9.5; B17 5.5,9.5; B18 6.5,9.5; B19 7.5,9.5; B20 8.5,9.5; B21 9.5,9.5; B22 10.5,9.5; C1 -10.5,8.5; C2 -9.5,8.5; C3 -8.5,8.5; C4 -7.5,8.5; C5 -6.5,8.5; C6 -5.5,8.5; C7 -4.5,8.5; C8 -3.5,8.5; C9 -2.5,8.5; C10 -1.5,8.5; C11 -0.5,8.5; C12 0.5,8.5; C13 1.5,8.5; C14 2.5,8.5; C15 3.5,8.5; C16 4.5,8.5; C17 5.5,8.5; C18 6.5,8.5; C19 7.5,8.5; C20 8.5,8.5; C21 9.5,8.5; C22 10.5,8.5; D1 -10.5,7.5; D2 -9.5,7.5; D3 -8.5,7.5; D4 -7.5,7.5; D5 -6.5,7.5; D6 -5.5,7.5; D7 -4.5,7.5; D8 -3.5,7.5; D9 -2.5,7.5; D10 -1.5,7.5; D11 -0.5,7.5; D12 0.5,7.5; D13 1.5,7.5; D14 2.5,7.5; D15 3.5,7.5; D16 4.5,7.5; D17 5.5,7.5; D18 6.5,7.5; D19 7.5,7.5; D20 8.5,7.5; D21 9.5,7.5; D22 10.5,7.5; E1 -10.5,6.5; E2 -9.5,6.5; E3 -8.5,6.5; E4 -7.5,6.5; E5 -6.5,6.5; E6 -5.5,6.5; E7 -4.5,6.5; E8 -3.5,6.5; E9 -2.5,6.5; E10 -1.5,6.5; E11 -0.5,6.5; E12 0.5,6.5; E13 1.5,6.5; E14 2.5,6.5; E15 3.5,6.5; E16 4.5,6.5; E17 5.5,6.5; E18 6.5,6.5; E19 7.5,6.5; E20 8.5,6.5; E21 9.5,6.5; E22 10.5,6.5; F1 -10.5,5.5; F2 -9.5,5.5; F3 -8.5,5.5; F4 -7.5,5.5; F5 -6.5,5.5; F6 -5.5,5.5; F7 -4.5,5.5; F8 -3.5,5.5; F9 -2.5,5.5; F10 -1.5,5.5; F11 -0.5,5.5; F12 0.5,5.5; F13 1.5,5.5; F14 2.5,5.5; F15 3.5,5.5; F16 4.5,5.5; F17 5.5,5.5; F18 6.5,5.5; F19 7.5,5.5; F20 8.5,5.5; F21 9.5,5.5; F22 10.5,5.5; G1 -10.5,4.5; G2 -9.5,4.5; G3 -8.5,4.5; G4 -7.5,4.5; G5 -6.5,4.5; G6 -5.5,4.5; G7 -4.5,4.5; G8 -3.5,4.5; G9 -2.5,4.5; G10 -1.5,4.5; G11 -0.5,4.5; G12 0.5,4.5; G13 1.5,4.5; G14 2.5,4.5; G15 3.5,4.5; G16 4.5,4.5; G17 5.5,4.5; G18 6.5,4.5; G19 7.5,4.5; G20 8.5,4.5; G21 9.5,4.5; G22 10.5,4.5; H1 -10.5,3.5; H2 -9.5,3.5; H3 -8.5,3.5; H4 -7.5,3.5; H5 -6.5,3.5; H6 -5.5,3.5; H7 -4.5,3.5; H8 -3.5,3.5; H9 -2.5,3.5; H10 -1.5,3.5; H11 -0.5,3.5; H12 0.5,3.5; H13 1.5,3.5; H14 2.5,3.5; H15 3.5,3.5; H16 4.5,3.5; H17 5.5,3.5; H18 6.5,3.5; H19 7.5,3.5; H20 8.5,3.5; H21 9.5,3.5; H22 10.5,3.5; J1 -10.5,2.5; J2 -9.5,2.5; J3 -8.5,2.5; J4 -7.5,2.5; J5 -6.5,2.5; J6 -5.5,2.5; J7 -4.5,2.5; J8 -3.5,2.5; J9 -2.5,2.5; J10 -1.5,2.5; J11 -0.5,2.5; J12 0.5,2.5; J13 1.5,2.5; J14 2.5,2.5; J15 3.5,2.5; J16 4.5,2.5; J17 5.5,2.5; J18 6.5,2.5; J19 7.5,2.5; J20 8.5,2.5; J21 9.5,2.5; J22 10.5,2.5; K1 -10.5,1.5; K2 -9.5,1.5; K3 -8.5,1.5; K4 -7.5,1.5; K5 -6.5,1.5; K6 -5.5,1.5; K7 -4.5,1.5; K8 -3.5,1.5; K9 -2.5,1.5; K10 -1.5,1.5; K11 -0.5,1.5; K12 0.5,1.5; K13 1.5,1.5; K14 2.5,1.5; K15 3.5,1.5; K16 4.5,1.5; K17 5.5,1.5; K18 6.5,1.5; K19 7.5,1.5; K20 8.5,1.5; K21 9.5,1.5; K22 10.5,1.5; L1 -10.5,0.5; L2 -9.5,0.5; L3 -8.5,0.5; L4 -7.5,0.5; L5 -6.5,0.5; L6 -5.5,0.5; L7 -4.5,0.5; L8 -3.5,0.5; L9 -2.5,0.5; L10 -1.5,0.5; L11 -0.5,0.5; L12 0.5,0.5; L13 1.5,0.5; L14 2.5,0.5; L15 3.5,0.5; L16 4.5,0.5; L17 5.5,0.5; L18 6.5,0.5; L19 7.5,0.5; L20 8.5,0.5; L21 9.5,0.5; L22 10.5,0.5; M1 -10.5,-0.5; M2 -9.5,-0.5; M3 -8.5,-0.5; M4 -7.5,-0.5; M5 -6.5,-0.5; M6 -5.5,-0.5; M7 -4.5,-0.5; M8 -3.5,-0.5; M9 -2.5,-0.5; M10 -1.5,-0.5; M11 -0.5,-0.5; M12 0.5,-0.5; M13 1.5,-0.5; M14 2.5,-0.5; M15 3.5,-0.5; M16 4.5,-0.5; M17 5.5,-0.5; M18 6.5,-0.5; M19 7.5,-0.5; M20 8.5,-0.5; M21 9.5,-0.5; M22 10.5,-0.5; N1 -10.5,-1.5; N2 -9.5,-1.5; N3 -8.5,-1.5; N4 -7.5,-1.5; N5 -6.5,-1.5; N6 -5.5,-1.5; N7 -4.5,-1.5; N8 -3.5,-1.5; N9 -2.5,-1.5; N10 -1.5,-1.5; N11 -0.5,-1.5; N12 0.5,-1.5; N13 1.5,-1.5; N14 2.5,-1.5; N15 3.5,-1.5; N16 4.5,-1.5; N17 5.5,-1.5; N18 6.5,-1.5; N19 7.5,-1.5; N20 8.5,-1.5; N21 9.5,-1.5; N22 10.5,-1.5; P1 -10.5,-2.5; P2 -9.5,-2.5; P3 -8.5,-2.5; P4 -7.5,-2.5; P5 -6.5,-2.5; P6 -5.5,-2.5; P7 -4.5,-2.5; P8 -3.5,-2.5; P9 -2.5,-2.5; P10 -1.5,-2.5; P11 -0.5,-2.5; P12 0.5,-2.5; P13 1.5,-2.5; P14 2.5,-2.5; P15 3.5,-2.5; P16 4.5,-2.5; P17 5.5,-2.5; P18 6.5,-2.5; P19 7.5,-2.5; P20 8.5,-2.5; P21 9.5,-2.5; P22 10.5,-2.5; R1 -10.5,-3.5; R2 -9.5,-3.5; R3 -8.5,-3.5; R4 -7.5,-3.5; R5 -6.5,-3.5; R6 -5.5,-3.5; R7 -4.5,-3.5; R8 -3.5,-3.5; R9 -2.5,-3.5; R10 -1.5,-3.5; R11 -0.5,-3.5; R12 0.5,-3.5; R13 1.5,-3.5; R14 2.5,-3.5; R15 3.5,-3.5; R16 4.5,-3.5; R17 5.5,-3.5; R18 6.5,-3.5; R19 7.5,-3.5; R20 8.5,-3.5; R21 9.5,-3.5; R22 10.5,-3.5; T1 -10.5,-4.5; T2 -9.5,-4.5; T3 -8.5,-4.5; T4 -7.5,-4.5; T5 -6.5,-4.5; T6 -5.5,-4.5; T7 -4.5,-4.5; T8 -3.5,-4.5; T9 -2.5,-4.5; T10 -1.5,-4.5; T11 -0.5,-4.5; T12 0.5,-4.5; T13 1.5,-4.5; T14 2.5,-4.5; T15 3.5,-4.5; T16 4.5,-4.5; T17 5.5,-4.5; T18 6.5,-4.5; T19 7.5,-4.5; T20 8.5,-4.5; T21 9.5,-4.5; T22 10.5,-4.5; U1 -10.5,-5.5; U2 -9.5,-5.5; U3 -8.5,-5.5; U4 -7.5,-5.5; U5 -6.5,-5.5; U6 -5.5,-5.5; U7 -4.5,-5.5; U8 -3.5,-5.5; U9 -2.5,-5.5; U10 -1.5,-5.5; U11 -0.5,-5.5; U12 0.5,-5.5; U13 1.5,-5.5; U14 2.5,-5.5; U15 3.5,-5.5; U16 4.5,-5.5; U17 5.5,-5.5; U18 6.5,-5.5; U19 7.5,-5.5; U20 8.5,-5.5; U21 9.5,-5.5; U22 10.5,-5.5; V1 -10.5,-6.5; V2 -9.5,-6.5; V3 -8.5,-6.5; V4 -7.5,-6.5; V5 -6.5,-6.5; V6 -5.5,-6.5; V7 -4.5,-6.5; V8 -3.5,-6.5; V9 -2.5,-6.5; V10 -1.5,-6.5; V11 -0.5,-6.5; V12 0.5,-6.5; V13 1.5,-6.5; V14 2.5,-6.5; V15 3.5,-6.5; V16 4.5,-6.5; V17 5.5,-6.5; V18 6.5,-6.5; V19 7.5,-6.5; V20 8.5,-6.5; V21 9.5,-6.5; V22 10.5,-6.5; W1 -10.5,-7.5; W2 -9.5,-7.5; W3 -8.5,-7.5; W4 -7.5,-7.5; W5 -6.5,-7.5; W6 -5.5,-7.5; W7 -4.5,-7.5; W8 -3.5,-7.5; W9 -2.5,-7.5; W10 -1.5,-7.5; W11 -0.5,-7.5; W12 0.5,-7.5; W13 1.5,-7.5; W14 2.5,-7.5; W15 3.5,-7.5; W16 4.5,-7.5; W17 5.5,-7.5; W18 6.5,-7.5; W19 7.5,-7.5; W20 8.5,-7.5; W21 9.5,-7.5; W22 10.5,-7.5; Y1 -10.5,-8.5; Y2 -9.5,-8.5; Y3 -8.5,-8.5; Y4 -7.5,-8.5; Y5 -6.5,-8.5; Y6 -5.5,-8.5; Y7 -4.5,-8.5; Y8 -3.5,-8.5; Y9 -2.5,-8.5; Y10 -1.5,-8.5; Y11 -0.5,-8.5; Y12 0.5,-8.5; Y13 1.5,-8.5; Y14 2.5,-8.5; Y15 3.5,-8.5; Y16 4.5,-8.5; Y17 5.5,-8.5; Y18 6.5,-8.5; Y19 7.5,-8.5; Y20 8.5,-8.5; Y21 9.5,-8.5; Y22 10.5,-8.5
SOIC127P600X175-8N = smd 1.5 x 0.7: 1 -2.7,1.905; 2 -2.7,0.635; 3 -2.7,-0.635; 4 -2.7,-1.905; 5 2.7,-1.905; 6 2.7,-0.635; 7 2.7,0.635; 8 2.7,1.905
2X5-SHROUDED = drill 1.016 pad 1.88: 1 -1.27,5.08; 2 1.27,5.08; 3 -1.27,2.54; 4 1.27,2.54; 5 -1.27,0; 6 1.27,0; 7 -1.27,-2.54; 8 1.27,-2.54; 9 -1.27,-5.08; 10 1.27,-5.08
1X01 = drill 1.016 octagon: 1 0,0
1X08 = drill 1.016 long: 1 -8.89,0; 2 -6.35,0; 3 -3.81,0; 4 -1.27,0; 5 1.27,0; 6 3.81,0; 7 6.35,0; 8 8.89,0
CHIP-LED0603 = smd 0.8 x 0.8: A 0,-0.75; C 0,0.75
RES-0402 = smd 0.5 x 0.6: P$1 -0.5,0; P$2 0.5,0
SW4-SMD-5.2X5.2X1.5MM = smd 1 x 0.7: 1 -3,1.85; 2 3,1.85; 3 -3,-1.85; 4 3,-1.85
SOT-223-3 = smd 1.5 x 4: P$1 3.25,0 | smd 1.5 x 1: P$2 -3.25,2.3; P$3 -3.25,0; P$4 -3.25,-2.3
OSCILLATOR-SMD-5X3.2 = smd 1.397 x 1.194: 1 -1.27,-1.1; 2 1.27,-1.1; 3 1.27,1.1; 4 -1.27,1.1

## Placement (x,y rotation side)
C1  0.1uF  [RESC0402_N]  2.56,66.3 90 top
C2  10uF  [RESC0805_N]  125,96 90 top
C3  0.1uF  [RESC0402_N]  123,96 90 top
C4  10uF  [RESC0805_N]  108.5,96 90 top
C5  0.1uF  [RESC0402_N]  106.5,96 90 top
C6  10uF  [RESC0805_N]  151.5,96 270 top
C7  0.1uF  [RESC0402_N]  153.5,96 270 top
C8  10uF  [RESC0805_N]  141.5,96 90 top
C9  0.1uF  [RESC0402_N]  139.5,96 90 top
C10  10uF  [RESC0805_N]  135,96 270 top
C11  0.1uF  [RESC0402_N]  137,96 270 top
C12  10uF  [RESC0805_N]  118.5,96 270 top
C13  0.1uF  [RESC0402_N]  120.5,96 270 top
C14  0.1uF  [RESC0402_N]  56.02,62.64 270 top
C15  0.1uF  [RESC0402_N]  45,102 90 top
C16  0.1uF  [RESC0402_N]  77.5,63.5 270 bottom
C17  0.1uF  [RESC0402_N]  79.5,47.5 90 bottom
C18  0.1uF  [RESC0402_N]  68.5,63.5 270 bottom
C19  0.1uF  [RESC0402_N]  65,66 180 bottom
C20  0.1uF  [RESC0402_N]  85,66 0 bottom
C21  0.1uF  [RESC0402_N]  68.5,47.5 90 bottom
C22  0.1uF  [RESC0402_N]  85,45 0 bottom
C23  0.1uF  [RESC0402_N]  65,45 180 bottom
C24  0.1uF  [RESC0402_N]  78,58 0 bottom
C25  0.1uF  [RESC0402_N]  69,50 180 bottom
C26  0.1uF  [RESC0402_N]  81.5,61.5 270 bottom
IC1  EP4CE30F23C6N  [BGA484C100P22X22_2300X2300X240]  75,55.5 0 top
IC2  EPCQ16ASI8N  [SOIC127P600X175-8N]  7.5,67.5 0 top
J1  2x5  [2X5-SHROUDED]  6.5,29.5 0 top
JP1  1  [1X01]  128.5,88 180 top
JP2  1  [1X01]  94.5,87.5 0 top
JP3  1x8  [1X08]  144,104.5 0 top
JP4  1  [1X01]  92,87.5 0 top
JP5  1  [1X01]  128.5,73 0 top
JP6  1  [1X01]  128.5,70.5 0 top
JP7  1  [1X01]  24,88 0 top
JP8  1  [1X01]  24,83 0 top
JP9  1  [1X01]  34,64 0 top
JP10  1  [1X01]  24,85.5 0 top
JP11  1  [1X01]  79.5,87.5 0 top
JP12  1  [1X01]  60.5,105 0 top
JP13  1  [1X01]  48,87.5 0 top
JP14  1  [1X01]  82,87.5 0 top
JP15  1  [1X01]  84.5,87.5 0 top
JP16  1  [1X01]  41.5,61.5 0 top
JP17  1  [1X01]  41.5,51.5 0 top
JP18  1  [1X01]  41.5,46.5 0 top
JP19  1  [1X01]  118.5,61.5 0 top
JP20  1  [1X01]  118.5,64 0 top
JP21  1  [1X01]  121,46.5 0 top
JP22  1  [1X01]  118.5,49 0 top
JP23  1  [1X01]  87,87.5 0 top
JP24  1  [1X01]  89.5,87.5 0 top
JP25  1  [1X01]  77,87.5 0 top
JP26  1  [1X01]  77,102.5 0 top
JP27  1  [1X01]  82,18 0 top
JP28  1  [1X01]  79.5,18 0 top
JP29  1  [1X01]  77,15.5 0 top
JP30  1  [1X01]  77,18 0 top
JP31  1  [1X01]  128.5,80.5 180 top
JP32  1  [1X01]  82,90 0 top
JP33  1  [1X01]  94.5,90 0 top
JP34  1  [1X01]  92,90 0 top
JP35  1  [1X01]  128.5,61.5 0 top
JP36  1  [1X01]  111,64 0 top
JP37  1  [1X01]  128.5,59 0 top
JP38  1  [1X01]  128.5,64 0 top
JP39  1  [1X01]  10,73 0 top
JP40  1  [1X01]  24,70.5 0 top
JP41  1  [1X01]  79.5,92.5 0 top
JP42  1  [1X01]  77,105 0 top
JP43  1  [1X01]  79.5,90 0 top
JP44  1  [1X01]  89.5,92.5 0 top
JP45  1  [1X01]  128.5,85.5 180 top
JP46  1  [1X01]  65.5,105 0 top
JP47  1  [1X01]  94.5,95 0 top
JP48  1  [1X01]  92,92.5 0 top
JP49  1  [1X01]  113.5,64 0 top
JP50  1  [1X01]  116,64 0 top
JP51  1  [1X01]  111,61.5 0 top
JP52  1  [1X01]  126,64 0 top
JP53  1  [1X01]  24,73 0 top
JP54  1  [1X01]  5,73 0 top
JP55  1  [1X01]  39,64 0 top
JP56  1  [1X01]  24,75.5 0 top
JP57  1  [1X01]  48,105 0 top
JP58  1  [1X01]  36.5,64 0 top
JP59  1  [1X01]  24,78 0 top
JP60  1  [1X01]  77,92.5 0 top
JP61  1  [1X01]  84.5,92.5 0 top
JP62  1  [1X01]  82,92.5 0 top
JP63  1  [1X01]  77,90 0 top
JP64  1  [1X01]  87,92.5 0 top
JP65  1  [1X01]  89.5,90 0 top
JP66  1  [1X01]  84.5,90 0 top
JP67  1  [1X01]  92,95 0 top
JP68  1  [1X01]  94.5,92.5 0 top
JP69  1  [1X01]  128.5,56.5 0 top
JP70  1  [1X01]  113.5,61.5 0 top
JP71  1  [1X01]  31.5,64 0 top
JP72  1  [1X01]  34,61.5 0 top
JP73  1  [1X01]  128.5,83 180 top
JP74  1  [1X01]  50.5,87.5 180 top
JP75  1  [1X01]  55.5,87.5 180 top
JP76  1  [1X01]  53,87.5 180 top
JP77  1  [1X01]  58,87.5 180 top
JP78  1  [1X01]  60.5,87.5 180 top
JP79  1  [1X01]  77,95 180 top
JP80  1  [1X01]  63,87.5 180 top
JP81  1  [1X01]  79.5,97.5 180 top
JP82  1  [1X01]  87,95 180 top
JP83  1  [1X01]  89.5,95 180 top
JP84  1  [1X01]  87,97.5 180 top
JP85  1  [1X01]  84.5,95 180 top
JP86  1  [1X01]  89.5,97.5 180 top
JP87  1  [1X01]  94.5,97.5 180 top
JP88  1  [1X01]  92,102.5 180 top
JP89  1  [1X01]  94.5,105 180 top
JP90  1  [1X01]  24,80.5 180 top
JP91  1  [1X01]  53,105 180 top
JP92  1  [1X01]  50.5,105 180 top
JP93  1  [1X01]  55.5,105 180 top
JP94  1  [1X01]  63,105 180 top
JP95  1  [1X01]  77,97.5 180 top
JP96  1  [1X01]  58,105 180 top
JP97  1  [1X01]  79.5,95 180 top
JP98  1  [1X01]  82,95 180 top
JP99  1  [1X01]  87,100 180 top
JP100  1  [1X01]  82,97.5 180 top
JP101  1  [1X01]  84.5,97.5 180 top
JP102  1  [1X01]  87,102.5 180 top
JP103  1  [1X01]  89.5,102.5 180 top
JP104  1  [1X01]  94.5,100 180 top
JP105  1  [1X01]  94.5,102.5 180 top
JP106  1  [1X01]  29,51.5 180 top
JP107  1  [1X01]  41.5,64 180 top
JP108  1  [1X01]  29,61.5 180 top
JP109  1  [1X01]  128.5,54 180 top
JP110  1  [1X01]  116,56.5 180 top
JP111  1  [1X01]  128.5,51.5 180 top
JP112  1  [1X01]  116,59 180 top
JP113  1  [1X01]  7.5,73 180 top
JP114  1  [1X01]  36.5,49 180 top
JP115  1  [1X01]  113.5,56.5 180 top
JP116  1  [1X01]  24,54 180 top
JP117  1  [1X01]  123.5,56.5 180 top
JP118  1  [1X01]  126,56.5 180 top
JP119  1  [1X01]  123.5,54 180 top
JP120  1  [1X01]  118.5,56.5 180 top
JP121  1  [1X01]  24,56.5 180 top
JP122  1  [1X01]  29,59 180 top
JP123  1  [1X01]  121,56.5 180 top
JP124  1  [1X01]  26.5,54 180 top
JP125  1  [1X01]  113.5,54 180 top
JP126  1  [1X01]  29,54 180 top
JP127  1  [1X01]  26.5,56.5 180 top
JP128  1  [1X01]  36.5,59 180 top
JP129  1  [1X01]  39,49 180 top
JP130  1  [1X01]  36.5,54 180 top
JP131  1  [1X01]  36.5,51.5 180 top
JP132  1  [1X01]  36.5,56.5 180 top
JP133  1  [1X01]  39,54 180 top
JP134  1  [1X01]  111,54 180 top
JP135  1  [1X01]  126,54 180 top
JP136  1  [1X01]  113.5,51.5 180 top
JP137  1  [1X01]  116,54 180 top
JP138  1  [1X01]  48,5.5 0 top
JP139  1  [1X01]  79.5,102.5 0 top
JP140  1  [1X01]  79.5,105 0 top
JP141  1  [1X01]  79.5,100 0 top
JP142  1  [1X01]  77,100 0 top
JP143  1  [1X01]  89.5,100 0 top
JP144  1  [1X01]  82,105 0 top
JP145  1  [1X01]  87,105 0 top
JP146  1  [1X01]  92,105 0 top
JP147  1  [1X01]  92,97.5 0 top
JP148  1  [1X01]  89.5,105 0 top
JP149  1  [1X01]  128.5,75.5 180 top
JP150  1  [1X01]  121,64 0 top
JP151  1  [1X01]  116,61.5 0 top
JP152  1  [1X01]  111,59 0 top
JP153  1  [1X01]  31.5,61.5 0 top
JP154  1  [1X01]  123.5,64 0 top
JP155  1  [1X01]  24,61.5 0 top
JP156  1  [1X01]  31.5,56.5 0 top
JP157  1  [1X01]  34,56.5 0 top
JP158  1  [1X01]  24,59 0 top
JP159  1  [1X01]  39,61.5 0 top
JP160  1  [1X01]  82,100 0 top
JP161  1  [1X01]  84.5,102.5 0 top
JP162  1  [1X01]  84.5,100 0 top
JP163  1  [1X01]  87,90 0 top
JP164  1  [1X01]  65.5,87.5 0 top
JP165  1  [1X01]  146.5,46.5 0 top
JP166  1  [1X01]  128.5,78 180 top
JP167  1  [1X01]  121,61.5 0 top
JP168  1  [1X01]  121,59 0 top
JP169  1  [1X01]  123.5,61.5 0 top
JP170  1  [1X01]  26.5,61.5 0 top
JP171  1  [1X01]  26.5,59 0 top
JP172  1  [1X01]  41.5,59 0 top
JP173  1  [1X01]  39,59 0 top
JP174  1  [1X01]  36.5,61.5 0 top
JP175  1  [1X01]  84.5,105 0 top
JP176  1  [1X01]  26.5,64 0 top
JP177  1  [1X01]  50.5,5.5 0 top
JP178  1  [1X01]  82,102.5 0 top
JP179  1  [1X01]  111,56.5 0 top
JP180  1  [1X01]  92,100 0 top
JP181  1  [1X01]  118.5,59 0 top
JP182  1  [1X01]  123.5,59 0 top
JP183  1  [1X01]  126,49 0 top
JP184  1  [1X01]  123.5,51.5 0 top
JP185  1  [1X01]  126,61.5 0 top
JP186  1  [1X01]  113.5,59 0 top
JP187  1  [1X01]  126,59 0 top
JP188  1  [1X01]  29,64 0 top
JP189  1  [1X01]  24,64 0 top
JP190  1  [1X01]  34,59 0 top
JP191  1  [1X01]  31.5,59 0 top
JP192  1  [1X01]  39,56.5 0 top
JP193  1  [1X01]  149,46.5 0 top
JP194  1  [1X01]  111,51.5 0 top
JP195  1  [1X01]  39,46.5 0 top
JP196  1  [1X01]  29,46.5 0 top
JP197  1  [1X01]  31.5,49 0 top
JP198  1  [1X01]  26.5,46.5 0 top
JP199  1  [1X01]  24,51.5 0 top
JP200  1  [1X01]  34,54 0 top
JP201  1  [1X01]  128.5,49 0 top
JP202  1  [1X01]  128.5,40 0 top
JP203  1  [1X01]  113.5,49 0 top
JP204  1  [1X01]  121,54 0 top
JP205  1  [1X01]  128.5,37.5 0 top
JP206  1  [1X01]  126,51.5 0 top
JP207  1  [1X01]  118.5,54 0 top
JP208  1  [1X01]  31.5,46.5 0 top
JP209  1  [1X01]  34,51.5 0 top
JP210  1  [1X01]  29,56.5 0 top
JP211  1  [1X01]  31.5,51.5 0 top
JP212  1  [1X01]  41.5,56.5 0 top
JP213  1  [1X01]  39,51.5 0 top
JP214  1  [1X01]  41.5,49 0 top
JP215  1  [1X01]  116,46.5 0 top
JP216  1  [1X01]  121,51.5 0 top
JP217  1  [1X01]  128.5,46.5 0 top
JP218  1  [1X01]  118.5,46.5 0 top
JP219  1  [1X01]  116,49 0 top
JP220  1  [1X01]  116,51.5 0 top
JP221  1  [1X01]  26.5,51.5 0 top
JP222  1  [1X01]  41.5,54 0 top
JP223  1  [1X01]  34,46.5 0 top
JP224  1  [1X01]  31.5,54 0 top
JP225  1  [1X01]  24,49 0 top
JP226  1  [1X01]  121,49 0 top
JP227  1  [1X01]  111,40 0 top
JP228  1  [1X01]  118.5,51.5 0 top
JP229  1  [1X01]  111,37.5 0 top
JP230  1  [1X01]  123.5,49 0 top
JP231  1  [1X01]  123.5,46.5 0 top
JP232  1  [1X01]  111,35 0 top
JP233  1  [1X01]  113.5,46.5 0 top
JP234  1  [1X01]  128.5,32.5 0 top
JP235  1  [1X01]  24,46.5 0 top
JP236  1  [1X01]  41.5,35 0 top
JP237  1  [1X01]  26.5,49 0 top
JP238  1  [1X01]  41.5,32.5 0 top
JP239  1  [1X01]  36.5,46.5 0 top
JP240  1  [1X01]  79.5,5.5 0 top
JP241  1  [1X01]  79.5,13 0 top
JP242  1  [1X01]  82,8 0 top
JP243  1  [1X01]  82,5.5 0 top
JP244  1  [1X01]  84.5,10.5 0 top
JP245  1  [1X01]  89.5,13 0 top
JP246  1  [1X01]  87,5.5 0 top
JP247  1  [1X01]  87,15.5 0 top
JP248  1  [1X01]  111,49 0 top
JP249  1  [1X01]  128.5,35 0 top
JP250  1  [1X01]  24,32.5 0 top
JP251  1  [1X01]  34,49 0 top
JP252  1  [1X01]  29,49 0 top
JP253  1  [1X01]  41.5,37.5 0 top
JP254  1  [1X01]  77,8 0 top
JP255  1  [1X01]  79.5,10.5 0 top
JP256  1  [1X01]  82,13 0 top
JP257  1  [1X01]  79.5,8 0 top
JP258  1  [1X01]  84.5,18 0 top
JP259  1  [1X01]  87,10.5 0 top
JP260  1  [1X01]  89.5,5.5 0 top
JP261  1  [1X01]  89.5,20.5 0 top
JP262  1  [1X01]  126,46.5 0 top
JP263  1  [1X01]  111,32.5 0 top
JP264  1  [1X01]  128.5,25 0 top
JP265  1  [1X01]  111,46.5 0 top
JP266  1  [1X01]  128.5,30 0 top
JP267  1  [1X01]  24,40 0 top
JP268  1  [1X01]  24,35 0 top
JP269  1  [1X01]  24,37.5 0 top
JP270  1  [1X01]  41.5,40 0 top
JP271  1  [1X01]  41.5,22.5 0 top
JP272  1  [1X01]  58,5.5 0 top
JP273  1  [1X01]  89.5,23 0 top
JP274  1  [1X01]  77,10.5 0 top
JP275  1  [1X01]  87,23 0 top
JP276  1  [1X01]  82,23 0 top
JP277  1  [1X01]  79.5,20.5 0 top
JP278  1  [1X01]  92,5.5 0 top
JP279  1  [1X01]  94.5,23 0 top
JP280  1  [1X01]  84.5,5.5 0 top
JP281  1  [1X01]  89.5,8 0 top
JP282  1  [1X01]  92,20.5 0 top
JP283  1  [1X01]  128.5,27.5 0 top
JP284  1  [1X01]  111,30 0 top
JP285  1  [1X01]  24,27.5 0 top
JP286  1  [1X01]  24,30 0 top
JP287  1  [1X01]  55.5,5.5 0 top
JP288  1  [1X01]  63,23 0 top
JP289  1  [1X01]  77,13 0 top
JP290  1  [1X01]  79.5,15.5 0 top
JP291  1  [1X01]  87,13 0 top
JP292  1  [1X01]  94.5,5.5 0 top
JP293  1  [1X01]  94.5,20.5 0 top
JP294  1  [1X01]  92,8 0 top
JP295  1  [1X01]  94.5,13 0 top
JP296  1  [1X01]  94.5,18 0 top
JP297  1  [1X01]  111,25 0 top
JP298  1  [1X01]  111,22.5 0 top
JP299  1  [1X01]  41.5,27.5 0 top
JP300  1  [1X01]  24,25 0 top
JP301  1  [1X01]  24,22.5 0 top
JP302  1  [1X01]  41.5,30 0 top
JP303  1  [1X01]  77,23 0 top
JP304  1  [1X01]  79.5,23 0 top
JP305  1  [1X01]  84.5,23 0 top
JP306  1  [1X01]  77,20.5 0 top
JP307  1  [1X01]  87,20.5 0 top
JP308  1  [1X01]  84.5,20.5 0 top
JP309  1  [1X01]  128.5,22.5 0 top
JP310  1  [1X01]  111,27.5 0 top
JP311  1  [1X01]  48,23 0 top
JP312  1  [1X01]  41.5,25 0 top
JP313  1  [1X01]  53,23 0 top
JP314  1  [1X01]  58,23 0 top
JP315  1  [1X01]  65.5,23 0 top
JP316  1  [1X01]  60.5,23 0 top
JP317  1  [1X01]  65.5,5.5 0 top
JP318  1  [1X01]  82,15.5 0 top
JP319  1  [1X01]  84.5,13 0 top
JP320  1  [1X01]  82,10.5 0 top
JP321  1  [1X01]  87,8 0 top
JP322  1  [1X01]  84.5,8 0 top
JP323  1  [1X01]  89.5,10.5 0 top
JP324  1  [1X01]  92,13 0 top
JP325  1  [1X01]  94.5,10.5 0 top
JP326  1  [1X01]  94.5,15.5 0 top
JP327  1  [1X01]  92,10.5 0 top
JP328  1  [1X01]  50.5,23 0 top
JP329  1  [1X01]  53,5.5 0 top
JP330  1  [1X01]  55.5,23 0 top
JP331  1  [1X01]  63,5.5 0 top
JP332  1  [1X01]  60.5,5.5 0 top
JP333  1  [1X01]  77,5.5 0 top
JP334  1  [1X01]  92,23 0 top
JP335  1  [1X01]  87,18 0 top
JP336  1  [1X01]  82,20.5 0 top
JP337  1  [1X01]  84.5,15.5 0 top
JP338  1  [1X01]  89.5,18 0 top
JP339  1  [1X01]  89.5,15.5 0 top
JP340  1  [1X01]  92,18 0 top
JP341  1  [1X01]  92,15.5 0 top
JP342  1  [1X01]  94.5,8 0 top
LED33  red  [CHIP-LED0603]  45.5,93 180 top
LED34  red  [CHIP-LED0603]  48.5,93 180 top
LED35  red  [CHIP-LED0603]  51.5,93 180 top
LED36  red  [CHIP-LED0603]  54.5,93 180 top
LED37  red  [CHIP-LED0603]  57.5,93 180 top
LED38  red  [CHIP-LED0603]  60.5,93 180 top
LED39  red  [CHIP-LED0603]  63.5,93 180 top
LED40  red  [CHIP-LED0603]  66,93 180 top
R1  10k  [RES-0402]  45,104.5 90 top
R2  10k  [RES-0402]  10,57.5 90 top
R3  10k  [RES-0402]  149,55 0 top
R4  0  [RES-0402]  5,46 180 top
R5  10k  [RES-0402]  5,49.5 180 top
R6  10k  [RES-0402]  149,51.5 0 top
R7  10k  [RES-0402]  149,58.5 0 top
R8  10k  [RES-0402]  149,62 0 top
R9  10k  [RES-0402]  149,65.5 0 top
R17  0  [RES-0402]  125,103.5 180 top
R18  0  [RES-0402]  108.5,100.5 180 top
R19  0  [RES-0402]  108.5,103.5 180 top
R20  0  [RES-0402]  125,100.5 180 top
R38  1k  [RES-0402]  66,96 270 top
R39  1k  [RES-0402]  63.5,96 270 top
R40  1k  [RES-0402]  60.5,96 270 top
R41  1k  [RES-0402]  57.5,96 270 top
R42  1k  [RES-0402]  54.5,96 270 top
R43  1k  [RES-0402]  51.5,96 270 top
R44  1k  [RES-0402]  48.5,96 270 top
R45  1k  [RES-0402]  45.5,96 270 top
SW1  SKQGADE010  [SW4-SMD-5.2X5.2X1.5MM]  5.5,55 0 top
SW2  SKQGADE010  [SW4-SMD-5.2X5.2X1.5MM]  40.5,102 0 top
U1  AMS1117-3.3  [SOT-223-3]  146.5,96 90 top
U2  AMS1117-2.5  [SOT-223-3]  130,96 90 top
U3  AMS1117-1.2  [SOT-223-3]  113.5,96 90 top
Y1  OSCILLATORSMD-5X3  [OSCILLATOR-SMD-5X3.2]  57.48,58.86 0 top

## Tracks (layer width: path | path; a pad name or v marks a point on that pad's centre or on a via)
1V2
  top 0.406: JP3.7 149.06,105.8 149.06,105.93 146.49,108.5 122.75,108.5 U3.P$1 | U3.P$1 U3.P$3 | R19.P$1 R18.P$1 109,99.5 | 109,99.5 109,97.5 C4.2 108.05,96.55 C5.2 | U3.P$1 109.25,99.25 109,99.5
2V5  (via drill 0.2)
  top 0.406: JP3.5 143.97,105.8 143.97,105.93 142.91,107 133.94,107 132.5,105.56 132.5,101.75 U2.P$1 | U2.P$1 U2.P$3 | 125.5,99 R20.P$1 R17.P$1 v125.5,105.5 | 125.5,99 125.5,97.5 C2.2 124.55,96.55 C3.2 | U2.P$1 125.75,99.25 125.5,99 | R39.P$1 v63.5,98
  pow1 0.406: v63.5,98 74.5,109 113.5,109 119,103.5 123.5,103.5 v125.5,105.5
3V3  (via drill 0.2)
  top 0.152: 115.5,92 115.8,92.3 U3.P$4 | v150.5,59 150,58.5 R7.P$2 R3.P$2 | J1.4 7.75,32.25 7.75,32.75 6.5,34 6.5,44 5,45.5 5,49 R5.P$2 4.5,54 8.5,58 R2.P$2 20,68 | R1.P$2 46.25,105 52.75,98.5 64.5,98.5 v65,98 65,97.5 R38.P$1 | C1.2 2.75,66.75 4.75,66.75 IC2.3 5,67 8.75,67 10,68.25 IC2.7 | v57,62 56.25,62 C14.2 56,62.25 53.75,62.25 48,68 20,68 | IC2.7 10.25,68.25 10.25,69.25 IC2.8 | 20,68 10.25,68 IC2.7
  top 0.406: C8.2 143.75,99.25 U1.P$1 U1.P$3 147.25,92.75 v147.5,92.5 | C8.2 140.19,98.31 JP3.3 | C8.2 141.05,96.55 C9.2 | C12.2 119.5,94 v119.5,93 | C12.2 116.25,92.75 U3.P$4 | C12.2 120.05,95 C13.2 | C14.2 56.02,60.15 Y1.4 | v118,101 118,98.34 117.5,97.84 117.5,96 C12.2
  pow1 0.152: v147.5,92.5 147.5,70 150.5,67 v150.5,59 | v57,62 v56.99,62
  pow1 0.305: 56.99,61.84 v56.99,62 56.99,83.49 | 65,91.5 65,96.5
  pow1 0.406: 56.99,83.49 59.91,86.41 60.95,86.41 61.59,87.05 61.59,88.09 65,91.5 | 65,96.5 v65,98 65,98.5 74.5,108 111,108 v118,101
  pow2 0.406: v119.5,93 147,93 v147.5,92.5
5V
  top 0.406: C7.2 151.95,95.45 C6.2 151.05,95 U1.P$4 148.8,91.3 148.5,91 141,91 138.5,93.5 138.5,95 | JP3.1 135.11,100.89 138.5,97.5 138.5,95 | 138.5,95 138.05,95.45 C11.2 136.55,95 C10.2 132.75,92.75 U2.P$4
ASDO  (via drill 0.2)
  top 0.089: IC1.D1 60,63 57,66 v52.25,66 | JP39.1 8.75,74.25 4.5,74.25 2,71.75 2,66.5 2.25,66.25 5.5,66.25 6,65.75 10,65.75 IC2.5
  pow1 0.089: v52.25,66 45.75,66 39.75,72 11,72 JP39.1
CLK1  (via drill 0.2)
  top 0.089: IC1.G1 58.79,60 Y1.3 58.75,60 58,60.75 v58,61
  sig2 0.089: v58,61 44.25,61 43.5,61.75 41.75,61.75 JP16.1
CLK2
  top 0.089: IC1.T2 65.25,51 | 65.25,51 65.1,51 64.67,51.42 61.58,51.42 | 65.25,51 64.75,51.5 60,51.5 59.75,51.25 47.25,51.25 47,51.5 45,51.5 43,49.5 43,48 JP18.1
CLK3  (via drill 0.2)
  top 0.089: IC1.T1 47,51 46.75,51.25 45.5,51.25 v45,50.75
  sig2 0.089: v45,50.75 42.25,50.75 JP17.1
CLK4
  top 0.089: IC1.G21 85,60.5 107.25,60.5 108.5,61.75 109,61.75 110.5,60.25 116.75,60.25 118.25,61.75 | 118,62 118.25,61.75 | 118.25,61.75 JP19.1
CLK5  (via drill 0.2)
  top 0.089: IC1.G22 107.5,60 v108.75,61.25
  sig2 0.089: v108.75,61.25 109.25,61.25 111,63 117.5,63 JP20.1
CLK6  (via drill 0.2)
  top 0.089: IC1.T21 85,50.5 88.75,50.5 89,50.25 94,50.25 v94.25,50.5
  pow1 0.089: v94.25,50.5 117,50.5 JP22.1
CLK7  (via drill 0.2)
  top 0.089: IC1.T22 89,51 v89.25,50.75
  pow1 0.089: v89.25,50.75 90.25,50.75 93.5,47.5 120,47.5 JP21.1
CLK8  (via drill 0.2)
  top 0.089: IC1.A12 75.5,67.5 74.75,68.25 v74.75,70.5 | v75.5,72.25 75.5,76.25 86.75,87.5 JP23.1
  sig2 0.089: v74.75,70.5 74.75,71.5 v75.5,72.25
CLK9  (via drill 0.2)
  top 0.089: IC1.B12 76,65.5 76,67.75 v75.5,68.25 | JP24.1 v79,77
  pow1 0.089: v75.5,68.25 78.5,71.25 78.5,76.5 v79,77
CLK10  (via drill 0.2)
  sig5 0.089: JP26.1 73.38,98.88 73.38,74.35 73.5,74.22 73.5,71.78 73.38,71.65 73.38,71.35 73.5,71.22 73.5,67 IC1.A11
  other vias: 74.5,66
CLK11
  top 0.089: IC1.B11 75,65.5 75,67.5 74.25,68.25 74.25,84.75 JP25.1
CLK12
  top 0.089: IC1.AB12 75.5,28.75 80.75,23.5 80.75,19.25 JP27.1
CLK13  (via drill 0.2)
  top 0.089: IC1.AA12 75,45.5 75,39.5 75.25,39.25 75.25,27.25 v78.5,24
  sig2 0.089: v78.5,24 78.5,19 JP28.1
CLK14  (via drill 0.2)
  top 0.089: IC1.AB11 74.5,40 74,39.5 74,27.75 v76,25.75
  sig2 0.089: v76,25.75 76,19 JP30.1
CLK15  (via drill 0.2)
  top 0.089: IC1.AA11 74,45.5 74,40 73.75,39.75 73.75,28.5 v73.5,28.25 | 77.5,16 JP29.1
  sig2 0.089: v73.5,28.25 73.5,19 JP29.1
CONF_DONE  (via drill 0.2)
  top 0.089: v145,55 R3.P$1
  sig2 0.089: 83.78,55.5 83.73,55.55 82.05,55.55 82,55.5 | IC1.M18 82,55.5 | 144.5,55.5 144.75,55.25 | 144.75,55.25 v145,55 | 82,55.5 82.75,55.5 83,55.75 83,56.25 83.25,56.5 90,56.5 91,55.5 116.5,55.5 116.75,55.25 144.75,55.25
  other vias: 81.5,55
DATA0  (via drill 0.2)
  top 0.089: IC1.K1 60.5,57 59.86,56.36 59.27,56.36 59.06,56.15 58.99,56.15 v58.97,56.13 | v57.25,60.25 57.25,61.5 57.5,61.75 57.5,62.75 55.5,64.75 51.75,64.75 48,68.5 12.5,68.5 8.75,72.25 | 8.75,72.25 8,73 JP113.1 | 8.75,72.25 8.75,72 5,68.25 IC2.2
  pow1 0.089: v58.97,56.13 58.97,58.53 v57.25,60.25
DCLK  (via drill 0.2)
  top 0.089: IC1.K2 65,57.5 60.28,57.5 59.59,56.81 58.81,56.81 57.95,55.95 57.27,55.95 57.22,56 47.96,56 v47.22,56.74 | v12,66.5 11.64,66.86 IC2.6
  sig5 0.089: v47.22,56.74 46.99,56.97 42.57,56.97 41.77,57.76 38.48,57.76 38.12,57.41 37.38,57.41 37.02,57.76 20.74,57.76 v12,66.5
GND  (via drill 0.2)
  top 0.152: IC1.H12 IC1.H13 | IC1.E18 81.86,62 82.31,62.45 82.69,62.45 83.14,62 IC1.E20 83.5,61.64 83.05,61.19 83.05,60.81 83.5,60.36 IC1.G20 | IC1.C12 IC1.C11 | IC1.Y16 IC1.Y15 78.14,47 77.69,47.45 76.31,47.45 75.86,47 IC1.Y12 IC1.Y11 74.14,47 73.69,47.45 73.31,47.45 72.86,47 IC1.Y9 | IC1.L11 IC1.K11 IC1.K10 IC1.L10 IC1.M10 IC1.N10 IC1.N11 IC1.M11 IC1.M12 IC1.N12 IC1.N13 IC1.M13 IC1.L13 IC1.L12 IC1.K12 IC1.K13 | IC1.AB6 69.5,45.36 69.05,45.81 69.05,46.45 IC1.Y5 67.95,47.55 67.31,47.55 66.86,48 IC1.W3 | IC1.AB1 IC1.AA2 65.5,46.36 65.95,46.81 65.95,47.45 IC1.W3 | 67.05,49.19 67.31,49.45 67.95,49.45 IC1.U5 | IC1.W3 67.05,48.55 67.05,49.19 | IC1.U3 67.05,49.45 67.05,49.19 | IC1.H3 IC1.G2 IC1.F3 66.86,61 67.31,60.55 67.69,60.55 68.14,61 IC1.F5 69.05,61.55 69.05,62.19 69.18,62.32 | 69.18,62.32 69.41,62.55 70.69,62.55 71.14,63 IC1.D8 IC1.C9 | 69.18,62.32 69.18,62.68 69.05,62.81 69.05,63.45 IC1.C5 | IC1.C12 75.86,64 76.31,64.45 76.69,64.45 77.14,64 IC1.C14 77.86,64 78.31,64.45 78.69,64.45 79.14,64 IC1.C16 | IC1.R3 66.5,52.36 66.05,52.81 66.05,53.19 66.5,53.64 IC1.N3 | IC1.F12 75.5,61.36 75.05,61.81 75.05,63.19 75.5,63.64 IC1.C12 | 58.51,58 Y1.2
  top 0.406: Y1.2 57.74,57.76 v57.5,58 | C10.1 134.5,97.6 v134.5,98.5 | v144.5,96.5 143.1,96.5 C8.1 142.05,94.9 U1.P$2 | C7.1 152.05,96.55 C6.1 152.89,98.49 JP3.8 | JP1.1 127.7,88.8 U2.P$2 125.55,94.9 C2.1 124.45,95.45 C3.1 121.9,96.55 C13.1 119.95,97.1 C12.1 | U3.P$2 109.05,94.9 C4.1 107.95,95.45 C5.1
  sig5 0.152: IC1.J15 C24.1 79.5,57.05 IC1.K16 | IC1.V18 81.5,48.57 81.9,48.17 81.9,47.83 81.5,47.43 IC1.Y18 | C25.1 IC1.U5 | C16.1 IC1.C14 | C26.1 IC1.E18 | IC1.L20 82.9,56.6 82.9,57.17 82.5,57.57 IC1.J19 | IC1.F12 76.1,60.4 76.1,59.83 76.5,59.43 IC1.H13 | IC1.T20 82.9,51.6 82.9,52.17 82.5,52.57 IC1.P19
  other vias: 79.5,64 81.5,64 81.5,62 82.5,58 78.5,58 79.5,57 73.5,54 76.5,57 68.5,50 77.5,64 83.5,56 78.5,54 78.5,56 82.5,53 83.5,51 83.5,49 83.5,47 76.5,52 74.5,52 74.5,47 75.5,47 81.5,49 81.5,47 66.5,52 66.5,50 66.5,48 72.5,47 72.5,52 68.5,47 71.5,53 72.5,58 66.5,59 66.5,57 66.5,54 66.5,61 68.5,61 66.5,63 68.5,64 72.5,64 74.5,64 71.5,63 76.5,59 75.5,61 83.5,62 83.5,60 64.5,45 64.5,66 85.5,66 85.5,45 79.5,47 75.5,55 74.5,56 65.5,46 85.5,46 43.5,99 46,101.5 45,91 48,91 51.5,91 54.5,91 57.5,91 61,91.5 63.5,91.5 66,91 55,64 8.5,52
  pour top: 163.91,112.5 163.53,-1.5 -2,-1.5 -2,112.5
  pour topgnd: 164,136 163.5,-13 -2,-13 -2,136
  pour sig2gnd: 164,135 163.5,-14.5 -2,-14.5 -2,135
  pour pow1: 164,134 163.5,-15.5 -2,-15.5 -2,134
  pour pow2: 164,133 163.5,-16.5 -2,-16.5 -2,133
  pour sig4gnd: 164,132 163.5,-17.5 -2,-17.5 -2,132
  pour sig5gnd: 164,131 163.5,-18.5 -2,-18.5 -2,131
  pour sig5: 163.94,113.5 163.56,-2.5 -2,-2.5 -2,113.5
IO1
  top 0.089: R1.P$1 C15.2 45,102.5 44,101.5 | 44,101.5 43.5,102 SW2.2 | 44,101.5 45.5,100 R45.P$1 47.25,94.75 47.25,90.75 JP74.1 66.25,71.75 66.25,69 66.5,68.75 IC1.A3
IO2  (via drill 0.2)
  top 0.089: v67.5,67.75 IC1.A4 | R44.P$1 50.75,94.25 50.75,89.75 JP76.1
  sig2 0.089: v67.5,67.75 53,82.25 JP76.1
IO3
  top 0.089: IC1.A5 68.5,70 55.5,83 JP75.1 53.75,89.25 53.75,94.25 R43.P$1
IO4  (via drill 0.2)
  top 0.089: v69.5,68.75 IC1.A6 | R42.P$1 56.75,94.25 56.75,88.75 JP77.1
  sig2 0.089: v69.5,68.75 69.5,76 JP77.1
IO5  (via drill 0.2)
  top 0.089: IC1.A7 70.5,69 69.75,69.75 69.75,70.75 62.25,78.25 v62.25,85.75 | R41.P$1 59.5,94.5 59.5,88.5 JP78.1
  sig2 0.089: JP78.1 v62.25,85.75
IO6
  top 0.089: IC1.A8 71.5,69.5 63,78 JP80.1 62.75,87.75 62.75,94.25 R40.P$1
IO7
  top 0.089: IC1.A9 72.5,90.5 JP79.1
IO8  (via drill 0.2)
  top 0.089: IC1.A10 73.5,70.5 73,71 73,89.25 v75.75,92
  pow1 0.089: v75.75,92 75.75,95.25 77,96.5 78.5,96.5 JP81.1
IO9  (via drill 0.2)
  top 0.089: IC1.A13 76.5,69 75.75,69.75 v75.5,69.75
  pow1 0.089: v75.5,69.75 75.5,70.5 77.5,72.5 77.5,76.25 83,81.75 83,95 84,96 86,96 JP82.1
IO10
  top 0.089: IC1.A14 77.5,69 74.75,71.75 74.75,78.5 83.25,87 83.25,90.5 84,91.25 87.5,91.25 88.25,92 88.25,96.25 JP84.1
IO11  (via drill 0.2)
  top 0.089: IC1.A15 78.5,75.75 v88,85.25
  pow1 0.089: v88,85.25 88,93.5 JP83.1
IO12  (via drill 0.2)
  top 0.089: IC1.A16 79.5,75.25 v79.25,75.5
  pow1 0.089: v79.25,75.5 79.25,76.5 83.25,80.5 83.25,93.75 JP85.1
IO13
  top 0.089: IC1.A17 80.5,69 82,70.5 82,78 90.75,86.75 90.75,96.25 JP86.1
IO14  (via drill 0.2)
  top 0.089: IC1.A18 81.5,69 84.75,72.25 v84.75,77.25
  sig4 0.089: v84.75,77.25 84.75,83.75 88.5,87.5 88.5,105.5 89,106 90,106 91,105 91,103.5 JP88.1
IO15  (via drill 0.2)
  top 0.089: IC1.A19 82.5,69 v83,69.5
  sig4 0.089: v83,69.5 95.75,82.25 95.75,96.25 JP87.1
IO16  (via drill 0.2)
  top 0.089: IC1.A20 83.5,70.5 85.75,72.75 85.75,78.25 v93,85.5
  pow2 0.089: v93,85.5 93,103.5 JP89.1
IO17
  top 0.089: IC1.B1 59.5,65 40.25,84.25 23.5,84.25 22.75,83.5 22.75,81.75 JP90.1
IO18
  top 0.089: IC1.B2 66.01,65.51 66.01,69 | 66.01,69 66.01,69.17 | 66.01,69 64.75,69 42.75,91 42.75,104.25 44.75,106.25 49.25,106.25 JP92.1
IO19  (via drill 0.2)
  top 0.089: IC1.B3 67,65.5 67,69 v66.75,69.25
  sig4 0.089: v66.75,69.25 66.75,91.25 JP91.1
IO20  (via drill 0.2)
  top 0.089: IC1.B4 68,65.5 68,69 v67.75,69
  sig2 0.089: v67.75,69 56.5,80.25 56.5,104 JP93.1
IO21  (via drill 0.2)
  top 0.089: IC1.B5 69,65.5 69,70 59.25,79.75 59.25,92.75 v59,93
  sig2 0.089: v59,93 63,97 JP94.1
IO22
  top 0.089: IC1.B6 70,65.5 70,69 69.5,69.5 69.5,70 61.75,77.75 61.75,89.75 59.75,91.75 59.75,96.75 60,97 62,97 63,96 66.5,96 66.5,97.5 60.25,103.75 59.25,103.75 JP96.1
IO23  (via drill 0.2)
  top 0.089: IC1.B7 71,65.5 71,69 70.5,69.5 v70.5,69.75
  pow1 0.089: v70.5,69.75 70.5,91 JP95.1
IO24
  top 0.089: IC1.B8 72,65.5 72,91.75 76.5,96.25 78.25,96.25 JP97.1
IO25
  top 0.089: IC1.B9 73,65.5 73,69 72.75,69.25 72.75,90 76.5,93.75 80.75,93.75 JP98.1
IO26  (via drill 0.2)
  top 0.089: IC1.B10 74,65.5 74,70.5 73.25,71.25 73.25,85.5 76.5,88.75 v79.75,88.75
  sig2 0.089: v79.75,88.75 81,90 81,96.5 JP100.1
IO27
  top 0.089: IC1.B13 77,65.5 77,69 74.5,71.5 74.5,80.75 80.75,87 80.75,93 81.5,93.75 85,93.75 85.75,94.5 85.75,98.75 JP99.1
IO28  (via drill 0.2)
  top 0.089: IC1.B14 78,65.5 78,72 77.5,72.5 77.5,77.5 v85.5,85.5
  sig2 0.089: v85.5,85.5 85.5,96.5 JP101.1
IO29  (via drill 0.2)
  top 0.089: IC1.B15 79,65.5 v79,73
  sig2 0.089: v79,73 81,75 81,80 88,87 88,101.5 JP102.1
IO30  (via drill 0.2)
  top 0.089: IC1.B16 80,65.5 80,69 81.75,70.75 81.75,78.25 89,85.5 v89,86.25
  pow1 0.089: v89,86.25 92.25,86.25 93.5,87.5 93.5,99 JP104.1
IO31
  top 0.089: IC1.B17 81,65.5 81,69 84.25,72.25 84.25,77.5 93,86.25 95,86.25 95.75,87 95.75,93 95,93.75 94,93.75 93.25,94.5 93.25,95.5 92.5,96.25 91.5,96.25 90.75,97 90.75,101.25 JP103.1
IO32  (via drill 0.2)
  top 0.089: IC1.B18 v82,65.5 82,69
  sig2 0.089: v82,65.5 82.75,65.5 96.25,79 96.25,100.75 JP105.1
IO33  (via drill 0.2)
  top 0.089: IC1.B19 83,65.5 v83,66.5
  sig2 0.089: v83,66.5 95.5,79 95.5,90.5 95,91 94,91 93,90 93,88.5 JP4.1
IO34  (via drill 0.2)
  top 0.089: IC1.B20 84,65.5 84,70.5 86,72.5 86,77 93.75,84.75 v94.5,84.75
  sig2 0.089: JP2.1 v94.5,84.75
IO35
  top 0.089: IC1.B21 85,65.5 88.5,65.5 96,73 JP5.1
IO36
  top 0.089: IC1.B22 88.5,65 94,70.5 JP6.1
IO37
  top 0.089: IC1.C1 63.5,64 62.75,64.75 59.25,64.75 41,83 JP8.1
IO38
  top 0.089: IC1.C2 65,64.5 65,66.25 43.25,88 JP7.1
IO39  (via drill 0.2)
  sig2 0.089: IC1.C3 63.5,64 63,63.5 57.25,63.5 55.5,65.25 35.25,65.25 JP9.1
  other vias: 66.5,64
IO40  (via drill 0.2)
  top 0.089: JP10.1 40.5,85.5 v57.75,68.25
  sig2 0.089: IC1.C4 67.03,64 66.65,64.37 61.63,64.37 v57.75,68.25
  other vias: 67.5,64
IO41  (via drill 0.2)
  pow2 0.089: IC1.C6 69.5,65 59.5,75 59.5,104 JP12.1
  other vias: 69.5,64
IO42  (via drill 0.2)
  sig2 0.089: IC1.C7 70.5,69 70,69.5 70,87 76.5,93.5 77.5,93.5 78.5,92.5 78.5,88.5 JP11.1
  other vias: 70.5,64
IO43  (via drill 0.2)
  sig4 0.089: IC1.C8 71.5,70 72,70.5 72,77.5 JP14.1
  other vias: 71.5,64
IO44  (via drill 0.2)
  pow1 0.089: IC1.C10 73.5,65 74.13,65.63 74.13,66.15 74.35,66.37 74.87,66.37 80,71.5 80,76.25 84.5,80.75 JP15.1
  other vias: 73.5,64
IO45  (via drill 0.2)
  pow2 0.089: IC1.C13 76.5,68.75 83,75.25 83,89 JP32.1
  other vias: 76.5,64
IO46  (via drill 0.2)
  sig2 0.089: IC1.C15 78.5,69 88,78.5 88,84 91,87 91,89 JP34.1
  other vias: 78.5,64
IO47  (via drill 0.2)
  sig2 0.089: IC1.C17 80.5,68.75 93.5,81.75 93.5,89 JP33.1
  other vias: 80.5,64
IO48  (via drill 0.2)
  sig2 0.089: 88.5,64.18 83.85,64.18 83.65,64.37 83.35,64.37 82.99,64.01 | IC1.C19 82.97,64 82.99,64.01 | JP35.1 127.5,62.5 127.5,64 123.25,68.25 86,68.25 83,65.25 83,64 82.99,64.01
  other vias: 82.5,64
IO49  (via drill 0.2)
  sig2 0.089: IC1.C20 94,64 97.5,67.5 107.5,67.5 JP36.1
  other vias: 83.5,64
IO50
  top 0.089: IC1.C21 85,64.5 88.5,64.5 91.75,67.75 124.75,67.75 JP38.1
IO51
  top 0.089: IC1.C22 88.5,64 92,67.5 124.25,67.5 127.25,64.5 127.25,60.25 JP37.1
IO53
  top 0.089: IC1.D2 65,63.5 60,63.5 56,67.5 50.5,67.5 43.75,74.25 23.5,74.25 22.75,73.5 22.75,71.75 JP40.1
IO54  (via drill 0.2)
  sig2 0.089: IC1.D6 69.5,63.48 69.87,63.85 69.87,68.87 70,69 69.75,69.25 69.75,97.75 JP42.1
  other vias: 69.5,63
IO55  (via drill 0.2)
  sig2 0.089: IC1.D7 70.5,63.48 70.87,63.85 70.87,68.87 71,69
  pow2 0.089: IC1.D7 71,63.5 71,69.5 77,75.5 77,86 76,87 76,90.5 77,91.5 78.5,91.5 JP41.1
  other vias: 70.5,63
IO56  (via drill 0.2)
  sig2 0.089: IC1.D10 73.5,63.48 73.87,63.85 | 73.87,63.85 73.87,61.85 73.65,61.63 73.35,61.63 72.89,62.09 | 74,69 73.87,68.87 73.87,63.85
  pow2 0.089: IC1.D10 74,63.5 74,71 75,72 75,72.5 78.5,76 78.5,89 JP43.1
  other vias: 73.5,63
IO57  (via drill 0.2)
  top 0.089: v78,72.75 78,76.75 88.25,87 88.25,91.25 JP44.1
  sig2 0.089: 76.32,69 76.32,64.35 76.13,64.15 76.13,63.85 76.5,63.48 IC1.D13
  pow2 0.089: IC1.D13 76,63.5 76,70.75 v78,72.75
  other vias: 76.5,63
IO58  (via drill 0.2)
  top 0.089: v82.5,73.75 82.5,76 84,77.5 84,77.75 93.25,87 93.25,91.25 JP48.1
  sig2 0.089: 78.32,64.35 78.13,64.15 78.13,63.85 78.5,63.48 IC1.D15
  pow2 0.089: IC1.D15 79,63.5 79,70.25 v82.5,73.75
  other vias: 78.5,63
IO59  (via drill 0.2)
  sig2 0.089: 80.32,69 80.32,64.35 80.13,64.15 80.13,63.85 80.5,63.48 IC1.D17
  sig4 0.089: IC1.D17 80.75,63 81.25,63.5 81.75,63.5 82,63.75 82,64.75 82.5,65.25 82.5,69.75 95.5,82.75 95.5,94 JP47.1
  other vias: 80.5,63
IO60  (via drill 0.2)
  sig2 0.089: IC1.D19 82.97,63 83.35,63.37 83.65,63.37 83.85,63.18 88.5,63.18
  sig4 0.089: IC1.D19 83,63.5 89.75,63.5 92.25,66 111.5,66 JP49.1
  other vias: 82.5,63
IO61  (via drill 0.2)
  sig2 0.089: IC1.D20 88.5,63
  pow1 0.089: IC1.D20 87.75,63 92.25,67.5 112.5,67.5 JP50.1
  other vias: 83.5,63
IO62  (via drill 0.2)
  top 0.089: IC1.D21 85,63.5 92.75,63.5 93.25,64 v109.5,64
  pow2 0.089: v109.5,64 110.5,63 125,63 JP52.1
IO63
  top 0.089: IC1.D22 109.5,63 JP51.1
IO64
  top 0.089: IC1.E1 59,62 55.75,65.25 51.75,65.25 46,71 26,71 JP53.1
IO66  (via drill 0.2)
  pow2 0.089: IC1.E3 61.25,62 47.75,75.5 JP56.1
  other vias: 66.5,62
IO67  (via drill 0.2)
  sig2 0.089: IC1.E4 67.03,62 66.65,62.37 61.63,62.37 61.5,62.5 57.75,62.5 55.25,65 40,65 JP55.1
  other vias: 67.5,62
IO68  (via drill 0.2)
  sig2 0.089: IC1.E5 68.03,62 67.65,61.63 61.63,61.63 61.5,61.5
  sig4 0.089: IC1.E5 68,61.5 61.5,61.5 58,65 37.5,65 JP58.1
  other vias: 68.5,62
IO69  (via drill 0.2)
  sig2 0.089: IC1.E6 69.03,62 68.48,62.55 61.95,62.55 61.5,63
  sig4 0.089: IC1.E6 69,62.5 61,62.5 45.5,78 JP59.1
  other vias: 69.5,62
IO70  (via drill 0.2)
  sig2 0.089: IC1.E7 70.5,62.48 71.05,63.02 71.05,68.55 71.25,68.75 | 71.25,68.75 71.32,68.82 71.32,69 | 71.25,68.75 71.25,69.75 75.75,74.25 75.75,91.25 JP60.1
  other vias: 70.5,62
IO71  (via drill 0.2)
  sig2 0.089: IC1.E9 72.5,62.48 72.13,62.85 72.13,64.15 72.5,64.53 72.5,69
  pow1 0.089: IC1.E9 72,62.5 72,71.25 81,80.25 81,91.5 JP62.1
  other vias: 72.5,62
IO72  (via drill 0.2)
  sig2 0.089: 73.32,69 73.32,64.35 73.13,64.15 73.13,62.85 73.5,62.48 IC1.E10
  pow1 0.089: IC1.E10 73,62.5 73,65 73.95,65.95 73.95,66.23 74.27,66.55 74.55,66.55 79.75,71.75 79.75,76.5 83.5,80.25 83.5,91.5 JP61.1
  other vias: 73.5,62
IO73  (via drill 0.2)
  sig2 0.089: IC1.E11 74.5,62.48 74.13,62.85 74.13,64.15 74.49,64.51 | JP63.1 76,89 76,71 74.5,69.5 74.5,66.53 74.87,66.15 74.87,64.9 74.49,64.51 | 74.5,64.5 74.49,64.51
  other vias: 74.5,62
IO74  (via drill 0.2)
  top 0.089: v86.25,66.75 86.25,76.5 v88.5,78.75
  sig2 0.089: IC1.E12 75.5,62.48 75.13,62.85 75.13,63.15 75.5,63.52
  pow2 0.089: IC1.E12 75,62.5 74.25,62.5 74,62.25 74,58.75 75.25,57.5 80.75,57.5 81,57.75 81,59.25 81.25,59.5 83.75,59.5 86.25,62 v86.25,66.75 | v88.5,78.75 88.5,91 JP64.1
  other vias: 75.5,62
IO75  (via drill 0.2)
  sig2 0.089: IC1.E13 76.5,62.48 76.65,62.63 | 76.65,62.63 76.87,62.85 76.87,68.87 77,69 77,69.75 78.5,71.25 78.5,82 83.5,87 83.5,89 JP66.1 | 76.65,62.63 76.35,62.63 75.95,63.02 75.95,64.23 76,64.28
  other vias: 76.5,62
IO76  (via drill 0.2)
  sig2 0.089: IC1.E14 77.5,62.48 77.13,62.85 77.13,64.15 77.5,64.53
  pow1 0.089: IC1.E14 78,62.5 78,67.75 v80,69.75
  sig4 0.089: v80,69.75 80,70.5 88,78.5 88,84.5 90.5,87 90.5,89 JP65.1
  other vias: 77.5,62
IO77  (via drill 0.2)
  sig2 0.089: IC1.E15 77.95,62.55 77.95,64.23 78,64.28 78,70.25 84.25,76.5 84.25,80.75 90.75,87.25 90.75,93.75 JP67.1
  other vias: 78.5,62
IO78  (via drill 0.2)
  sig2 0.089: IC1.E16 79.5,62.48 79.13,62.85 79.13,64.15 79.5,64.53
  sig4 0.089: IC1.E16 79.5,62.25 80,62.75 80,63.25 80.25,63.5 80.75,63.5 81,63.75 81,68.75 93.5,81.25 93.5,91.5 JP68.1
  other vias: 79.5,62
IO79  (via drill 0.2)
  top 0.089: IC1.E21 85,62.5 v106.25,62.5
  pow1 0.089: v106.25,62.5 112.5,62.5 JP70.1
IO80  (via drill 0.2)
  top 0.089: v104.5,62 IC1.E22
  pow1 0.089: v104.5,62 108.5,58 127,58 JP69.1
IO81  (via drill 0.2)
  top 0.089: IC1.F1 59.25,61 v58.25,62
  sig2 0.089: v58.25,62 57.75,62 56.5,63.25 42.25,63.25 42,63 32.5,63 JP71.1
IO82  (via drill 0.2)
  top 0.089: IC1.F2 65,61.5 v59.75,61.5
  sig2 0.089: v59.75,61.5 44.25,61.5 43.25,62.5 35,62.5 JP72.1
IO83  (via drill 0.2)
  sig4 0.089: IC1.F7 70.5,61.48 70.13,61.85 70.13,66.87 70,67 70,97 77,104 78.5,104 JP140.1
  other vias: 70.5,61
IO84  (via drill 0.2)
  sig4 0.089: IC1.F8 71,61.5 71,70 70.75,70.25 70.75,79.75 78.5,87.5 78.5,101.5 JP139.1
  other vias: 71.5,61
IO85  (via drill 0.2)
  top 0.089: v97.25,80 97.25,104 95,106.25 84,106.25 83.25,105.5 83.25,104.5 82.5,103.75 81.5,103.75 80.75,103 80.75,101.25 JP141.1
  pow2 0.089: IC1.F9 73,60.5 73,57.75 74.25,56.5 81.75,56.5 82,56.75 82,58.25 82.25,58.5 84.75,58.5 97.25,71 v97.25,80
  sig4 0.089: IC1.F9 72,61.5 72,69
  other vias: 72.5,61
IO86  (via drill 0.2)
  pow2 0.089: v73.75,78.5 73,78.5 64.5,87 64.5,88 76.5,100 JP142.1
  sig4 0.089: IC1.F10 73.5,61.48 73.13,61.85 73.13,64.15 73.5,64.53 73.5,69 72.25,70.25 72.25,77 v73.75,78.5
  other vias: 73.5,61
IO87  (via drill 0.2)
  top 0.089: v71.25,70.5 71.25,98.5 76.5,103.75 80.75,103.75 JP144.1
  sig4 0.089: IC1.F11 74.5,61.48 74.13,61.85 74.13,64.15 74.5,64.53
  sig5 0.089: IC1.F11 74,61.5 74,66.25 73.32,66.93 73.32,68.43 v71.25,70.5
  other vias: 74.5,61
IO88  (via drill 0.2)
  pow1 0.089: v73.75,74.5 73.75,75.75 78.5,80.5 78.5,95.5 79.5,96.5 85,96.5 86,97.5 86,98 87,99 88.5,99 JP143.1
  sig4 0.089: IC1.F13 76.5,61.48 76.13,61.85 76.13,64.15 76.5,64.53 76.5,70.5 73.75,73.25 v73.75,74.5
  other vias: 76.5,61
IO89  (via drill 0.2)
  pow2 0.089: v76.75,72.5 76.75,73.75 81,78 81,98 82,99 85,99 86,100 86,104 JP145.1
  sig4 0.089: IC1.F14 77.5,61.48 77.13,61.85 77.13,64.15 77.5,64.53 77.5,71.75 v76.75,72.5
  other vias: 77.5,61
IO90  (via drill 0.2)
  sig4 0.089: IC1.F15 78.5,61.48 78.13,61.85 78.13,64.15 78.5,64.53 78.5,79.5 86,87 86,105.5 86.75,106.25 90.75,106.25 JP146.1
  other vias: 78.5,61
IO91  (via drill 0.2)
  sig2 0.089: IC1.F16 78.95,61.55 78.95,64.23 79,64.28 79,69
  sig4 0.089: IC1.F16 79,61.5 79,63.25 79.25,63.5 79.75,63.5 80,63.75 80,68.25 90.75,79 90.75,103.75 JP148.1
  other vias: 79.5,61
IO92  (via drill 0.2)
  top 0.089: v86.75,75.75 86.75,76.25 96.25,85.75 96.25,95.75 95.75,96.25 93.25,96.25 JP147.1
  sig2 0.089: IC1.F17 79.95,61.55 79.95,64.23 80,64.28 80,69 v86.75,75.75
  other vias: 80.5,61
IO93  (via drill 0.2)
  sig2 0.089: IC1.F19 82.97,61 83.35,61.37 83.65,61.37 83.85,61.18 88.5,61.18
  sig4 0.089: IC1.F19 83,61.5 106,61.5 107.5,63 120,63 JP150.1
  other vias: 82.5,61
IO94  (via drill 0.2)
  top 0.089: v93.5,63.5 109.75,63.5 110.5,62.75 114.75,62.75 JP151.1
  sig2 0.089: IC1.F20 91,61 v93.5,63.5
  other vias: 83.5,61
IO95  (via drill 0.2)
  top 0.089: IC1.F21 85,61.5 v106.75,61.5
  pow2 0.089: v106.75,61.5 107.75,61.5 110.25,59 JP152.1
IO96  (via drill 0.2)
  top 0.089: IC1.F22 107,61 v108,62
  sig4 0.089: v108,62 108.75,62.75 122.25,62.75 JP154.1
IO97  (via drill 0.2)
  sig2 0.089: IC1.G3 58.25,60 57.25,59 43,59 41.75,60.25 32.75,60.25 JP153.1
  other vias: 66.5,60
IO98  (via drill 0.2)
  sig2 0.089: IC1.G4 67.03,60 66.65,60.37 66.35,60.37 66.15,60.18 61.82,60.18
  pow2 0.089: IC1.G4 67,60.5 62.25,60.5 57.5,65.25 23.75,65.25 23,64.5 23,62.5 JP155.1
  other vias: 67.5,60
IO99  (via drill 0.2)
  sig2 0.089: IC1.G5 67.95,60.55 66.27,60.55 66.22,60.5 62,60.5 61.5,61 58.75,61 57.5,59.75 44,59.75 43.25,60.5 33.5,60.5 32.5,61.5 32.5,62 32,62.5 31,62.5 30.5,62 30.5,57.5 JP156.1
  other vias: 68.5,60
IO100  (via drill 0.2)
  sig2 0.089: v63.25,65.5 61.25,65.5 58,68.75 29.75,68.75 25,64 25,60 JP158.1
  sig4 0.089: IC1.G7 70.03,60 69.65,59.63 66.35,59.63 65.97,60
  sig5 0.089: IC1.G7 70,60.5 69.25,60.5 69,60.75 69,61.25 68.75,61.5 67.25,61.5 67,61.75 67,62.25 66.75,62.5 66.25,62.5 v63.25,65.5
  other vias: 70.5,60
IO101  (via drill 0.2)
  pow2 0.089: JP157.1 33,56.5 31.5,58 31,58 30.5,58.5 30.5,62 31.5,63 45.25,63 46.75,64.5 53.75,64.5 57.75,60.5 v61,60.5
  sig4 0.089: IC1.G8 71.03,60 70.65,60.37 66.35,60.37 66.15,60.18 61.82,60.18 61.5,60.5 v61,60.5
  other vias: 71.5,60
IO102  (via drill 0.2)
  top 0.089: JP159.1 39.75,61.5 41,62.75 v52.5,62.75
  sig4 0.089: IC1.G9 72.03,60 71.48,60.55 66.27,60.55 66.22,60.5 62,60.5 59.75,62.75 v52.5,62.75
  other vias: 72.5,60
IO103  (via drill 0.2)
  top 0.089: v88,67.75 88,76.5 97,85.5 97,101.75 95,103.75 84,103.75 83.25,103 83.25,101.25 JP160.1
  pow1 0.089: IC1.G10 74,59.5 74,58.75 75.25,57.5 76.25,57.5 77.25,58.5 79.25,58.5 80.25,59.5 82.75,59.5 83,59.75 83,63.25 83.25,63.5 83.75,63.5 v88,67.75
  sig4 0.089: 73,69 73,64.28 72.95,64.23 72.95,60.55 IC1.G10
  other vias: 73.5,60
IO104  (via drill 0.2)
  sig4 0.089: IC1.G11 73.95,60.55 73.95,64.23 74,64.28 74,70.5 73,71.5 73,76.5 83.5,87 83.5,99 JP162.1
  other vias: 74.5,60
IO105  (via drill 0.2)
  sig4 0.089: IC1.G13 75.95,60.55 75.95,64.23 76,64.28 76,70.25 73.25,73 73.25,74.75 85.5,87 85.5,101.5 JP161.1
  other vias: 76.5,60
IO106  (via drill 0.2)
  top 0.089: v77,70.5 76.5,70.5 75,72 75,76.25 85.75,87 85.75,88.75 JP163.1
  sig4 0.089: v77,70.5 77,64.28 76.95,64.23 76.95,60.55 IC1.G14
  other vias: 77.5,60
IO107  (via drill 0.2)
  pow2 0.089: JP164.1 v76.5,76.5
  sig4 0.089: IC1.G15 77.95,60.55 77.95,64.23 78,64.28 78,72 76.5,73.5 v76.5,76.5
  other vias: 78.5,60
IO108  (via drill 0.2)
  top 0.089: v92.5,65.5 93.75,65.5 94,65.75 118.5,65.75 119.75,64.5 119.75,60.25 JP168.1
  sig4 0.089: IC1.G16 80,60.5 80,62.25 80.25,62.5 89.5,62.5 v92.5,65.5
  sig5 0.089: 88.5,60.5 81.89,60.5 81.87,60.48 79.98,60.48 IC1.G16
  other vias: 79.5,60
IO109  (via drill 0.2)
  sig2 0.089: IC1.G17 81.05,60.55 82.73,60.55 82.78,60.5 88.5,60.5
  sig4 0.089: IC1.G17 81.05,60.55 83.73,60.55 83.78,60.5 107.25,60.5 109.25,62.5 120,62.5 JP167.1
  other vias: 80.5,60
IO110  (via drill 0.2)
  sig4 0.089: IC1.G18 81.97,60 82.35,60.37 83.65,60.37 84.03,60 110,60 110.5,60.5 122.5,60.5 JP169.1
  other vias: 81.5,60
IO111  (via drill 0.2)
  top 0.089: IC1.H1 45.5,59 v43.25,61.25
  pow1 0.089: v43.25,61.25 42,62.5 27.5,62.5 JP170.1
IO112  (via drill 0.2)
  top 0.089: IC1.H2 65,59.5 v60,59.5
  pow2 0.089: v60,59.5 57.25,59.5 54,56.25 47,56.25 44.25,59 JP172.1
IO113  (via drill 0.2)
  sig2 0.089: IC1.H5 68.03,59 67.65,58.63 66.35,58.63 65.97,59 61.5,59
  pow1 0.089: IC1.H5 68,59.5 66.25,59.5 62.25,63.5 62.25,64.25 62,64.5 60,64.5 57.5,62 57.5,61.75 53.5,57.75 27.75,57.75 JP171.1
  other vias: 68.5,59
IO114  (via drill 0.2)
  sig2 0.089: IC1.H6 69.03,59 68.65,59.37 66.35,59.37 66.15,59.18 61.82,59.18 61.5,59.5 61,59.5 60.25,58.75 42.75,58.75 42,58 40,58 JP173.1
  other vias: 69.5,59
IO115  (via drill 0.2)
  top 0.089: v53.25,62 43.25,62 42.75,61.5 42.75,61 42,60.25 37.75,60.25 JP174.1
  sig4 0.089: IC1.H7 70.03,59 69.65,58.63 66.35,58.63 65.97,59 61.5,59 59,61.5 53.75,61.5 v53.25,62
  other vias: 70.5,59
IO116  (via drill 0.2)
  sig4 0.089: IC1.H8 71.03,59 70.65,59.37 62.13,59.37 62,59.5 | JP176.1 26.5,66.5 23,70 23,78.5 23.5,79 47.75,79 v62.75,64
  sig5 0.089: v62.75,64 66.25,60.5 68.75,60.5 69,60.25 69,59.75 69.25,59.5 71,59.5 IC1.H8
  other vias: 71.5,59
IO117  (via drill 0.2)
  sig4 0.089: IC1.H10 74.13,59.63 74.65,59.63 75,59.98 75,69 | JP175.1 83.5,105 82.5,106 76.5,106 67.25,96.75 67.25,69 v65.5,67.25
  sig5 0.089: v65.5,67.25 66.25,67.25 69,64.5 69,63.75 69.25,63.5 69.75,63.5 70,63.25 70,62.75 70.25,62.5 70.75,62.5 71,62.25 71,61.75 71.25,61.5 71.75,61.5 72,61.25 72,60.75 72.25,60.5 72.75,60.5 73,60.25 73,59.75 73.5,59.25 IC1.H10
  other vias: 73.5,59
IO118  (via drill 0.2)
  pow2 0.089: JP178.1 82,101.5 80.5,100 80.5,92 79.5,91 79,91 78,90 78,76 73.75,71.75 v73.75,71.5
  sig5 0.089: IC1.H11 75,59.5 75,69 73.75,70.25 v73.75,71.5
  other vias: 74.5,59
IO119  (via drill 0.2)
  sig4 0.089: IC1.H14 77.97,59 78.35,59.37 79.6,59.37 80.35,58.63 88.37,58.63 88.5,58.5 94,58.5 96,56.5 JP179.1
  other vias: 77.5,59
IO120  (via drill 0.2)